# EAGLE design hoektronics-cnc-controller (EAGLE 5.12)

## Sheet 1 of 9
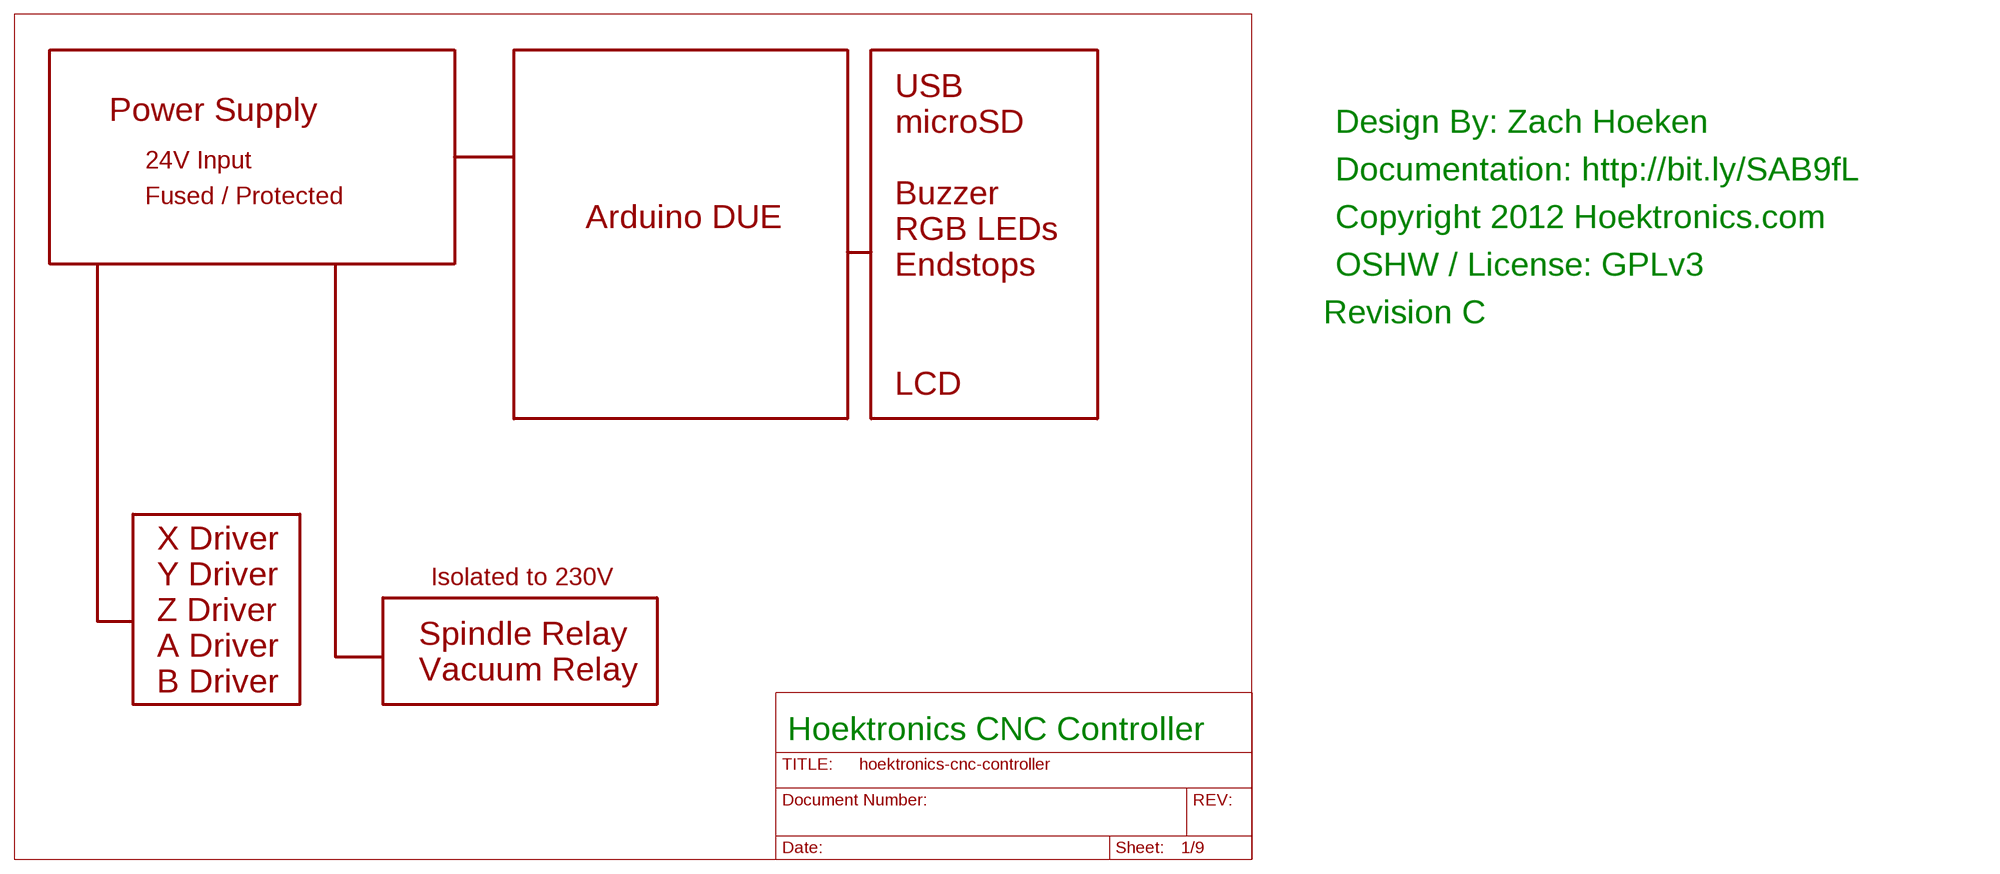
[diagram p0: schematic, sheet 1]

### Notes on the sheet
- USB
- Power Supply
- microSD | Design By: Zach Hoeken
- 24V Input
- Documentation: http://bit.ly/SAB9fL
- Fused / Protected | Buzzer
- Arduino DUE | Copyright 2012 Hoektronics.com
- RGB LEDs
- Endstops | OSHW / License: GPLv3
- Revision C
- LCD
- X Driver
- Y Driver | Isolated to 230V
- Z Driver
- Spindle Relay
- A Driver
- Vacuum Relay
- B Driver
- Hoektronics CNC Controller

## Sheet 2 of 9
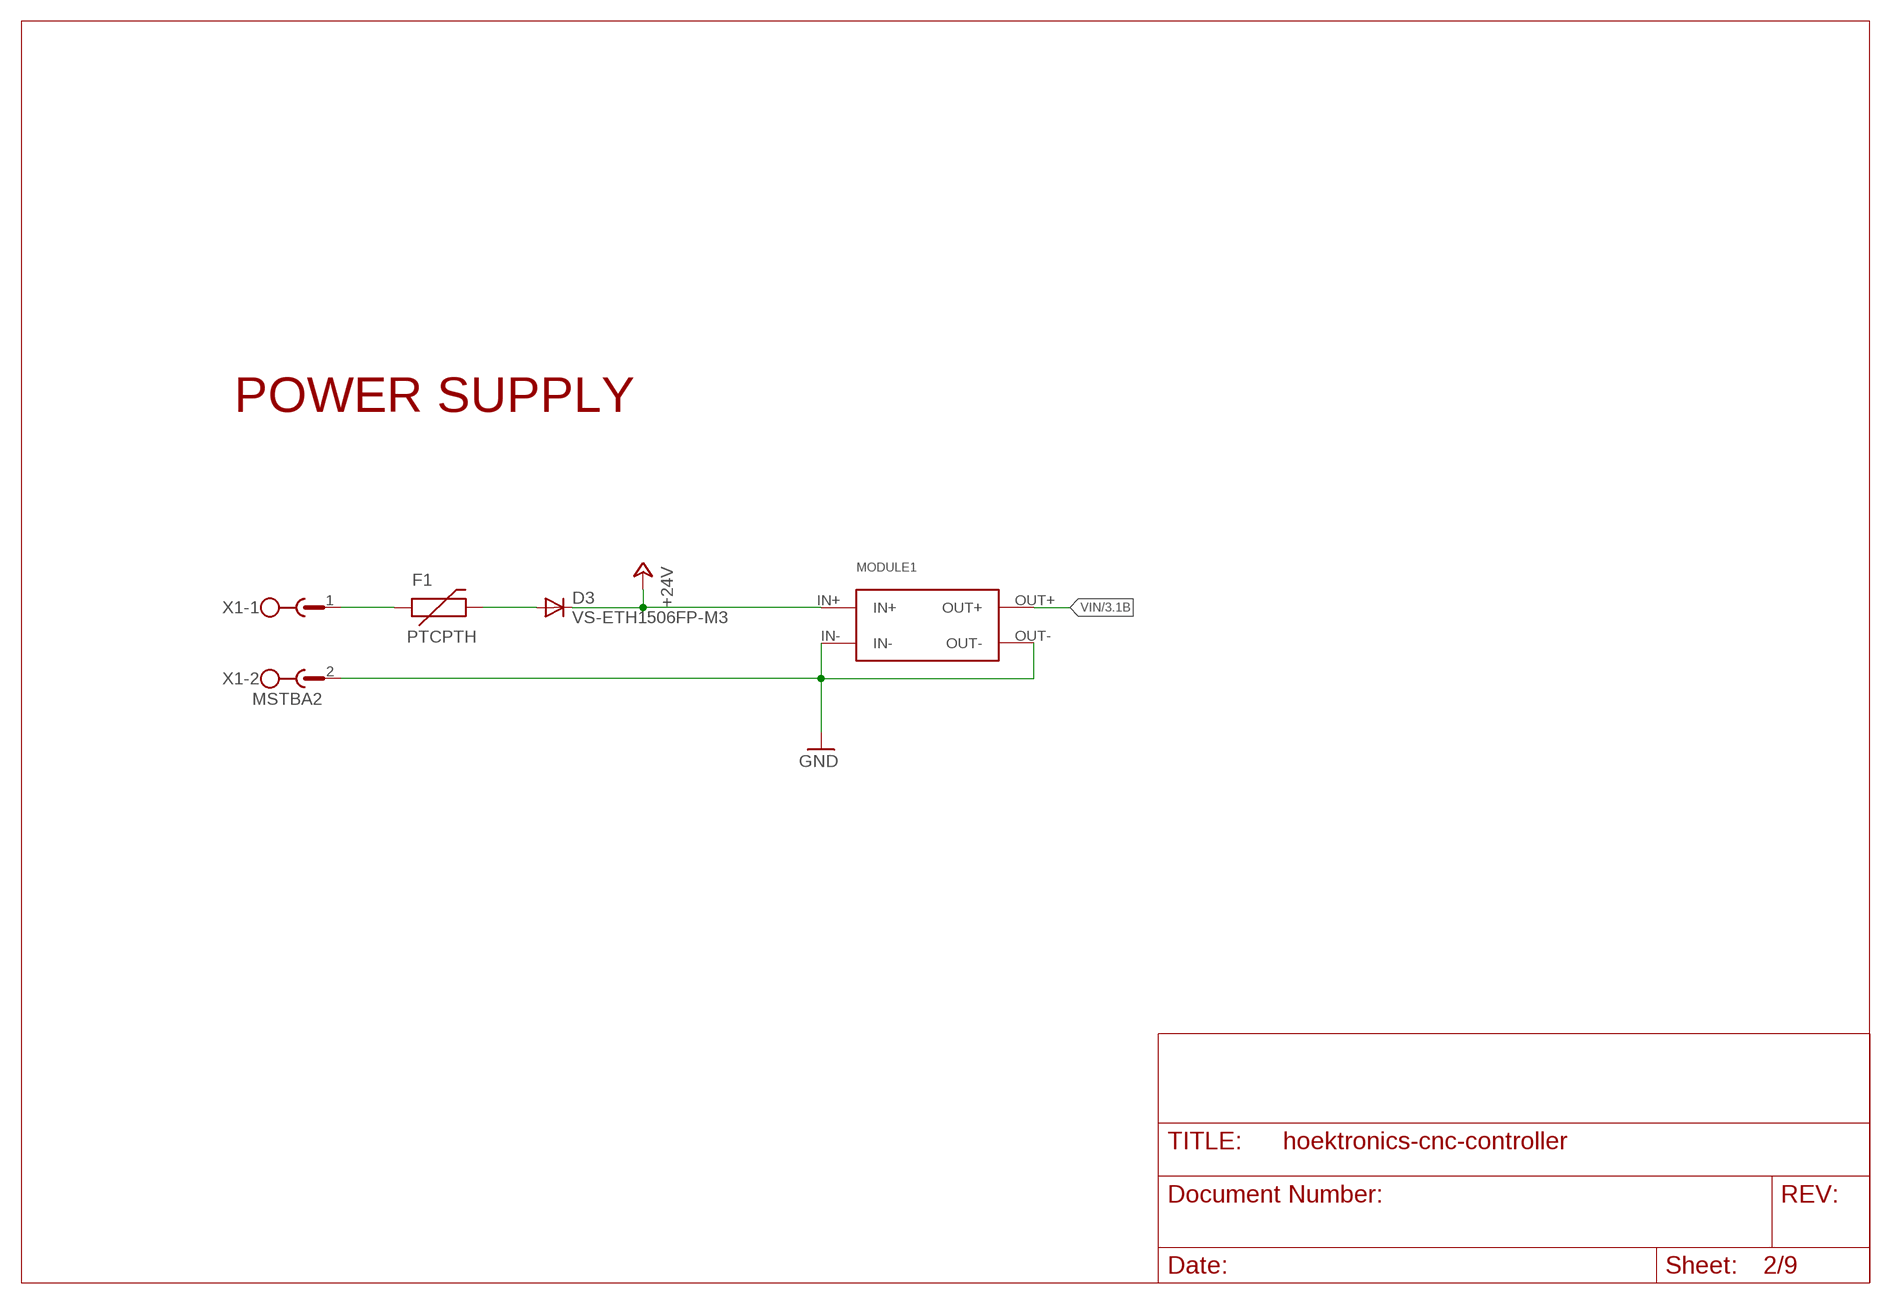
[diagram p1: schematic, sheet 2]

### Parts
D3  VS-ETH1506FP-M3  DIODE-SMC  [SMC]
F1  PTCPTH  [PTC]
MODULE1  DC-DC-CONVERTER  [DC-DC-MODULE]
X1  MSTBA2  [MSTBA2]

### Nets
+24V [power]: D3.C MODULE1.IN+
GND [gnd]: MODULE1.IN- MODULE1.OUT- X1.2 ; also sheet 3,4,5,6,7,8,9
N$28 [power]: D3.A F1.P$2
PRE24 [power]: F1.P$1 X1.1
VIN [power]: MODULE1.OUT+ ; also sheet 3,6

### Notes on the sheet
- POWER SUPPLY

## Sheet 3 of 9
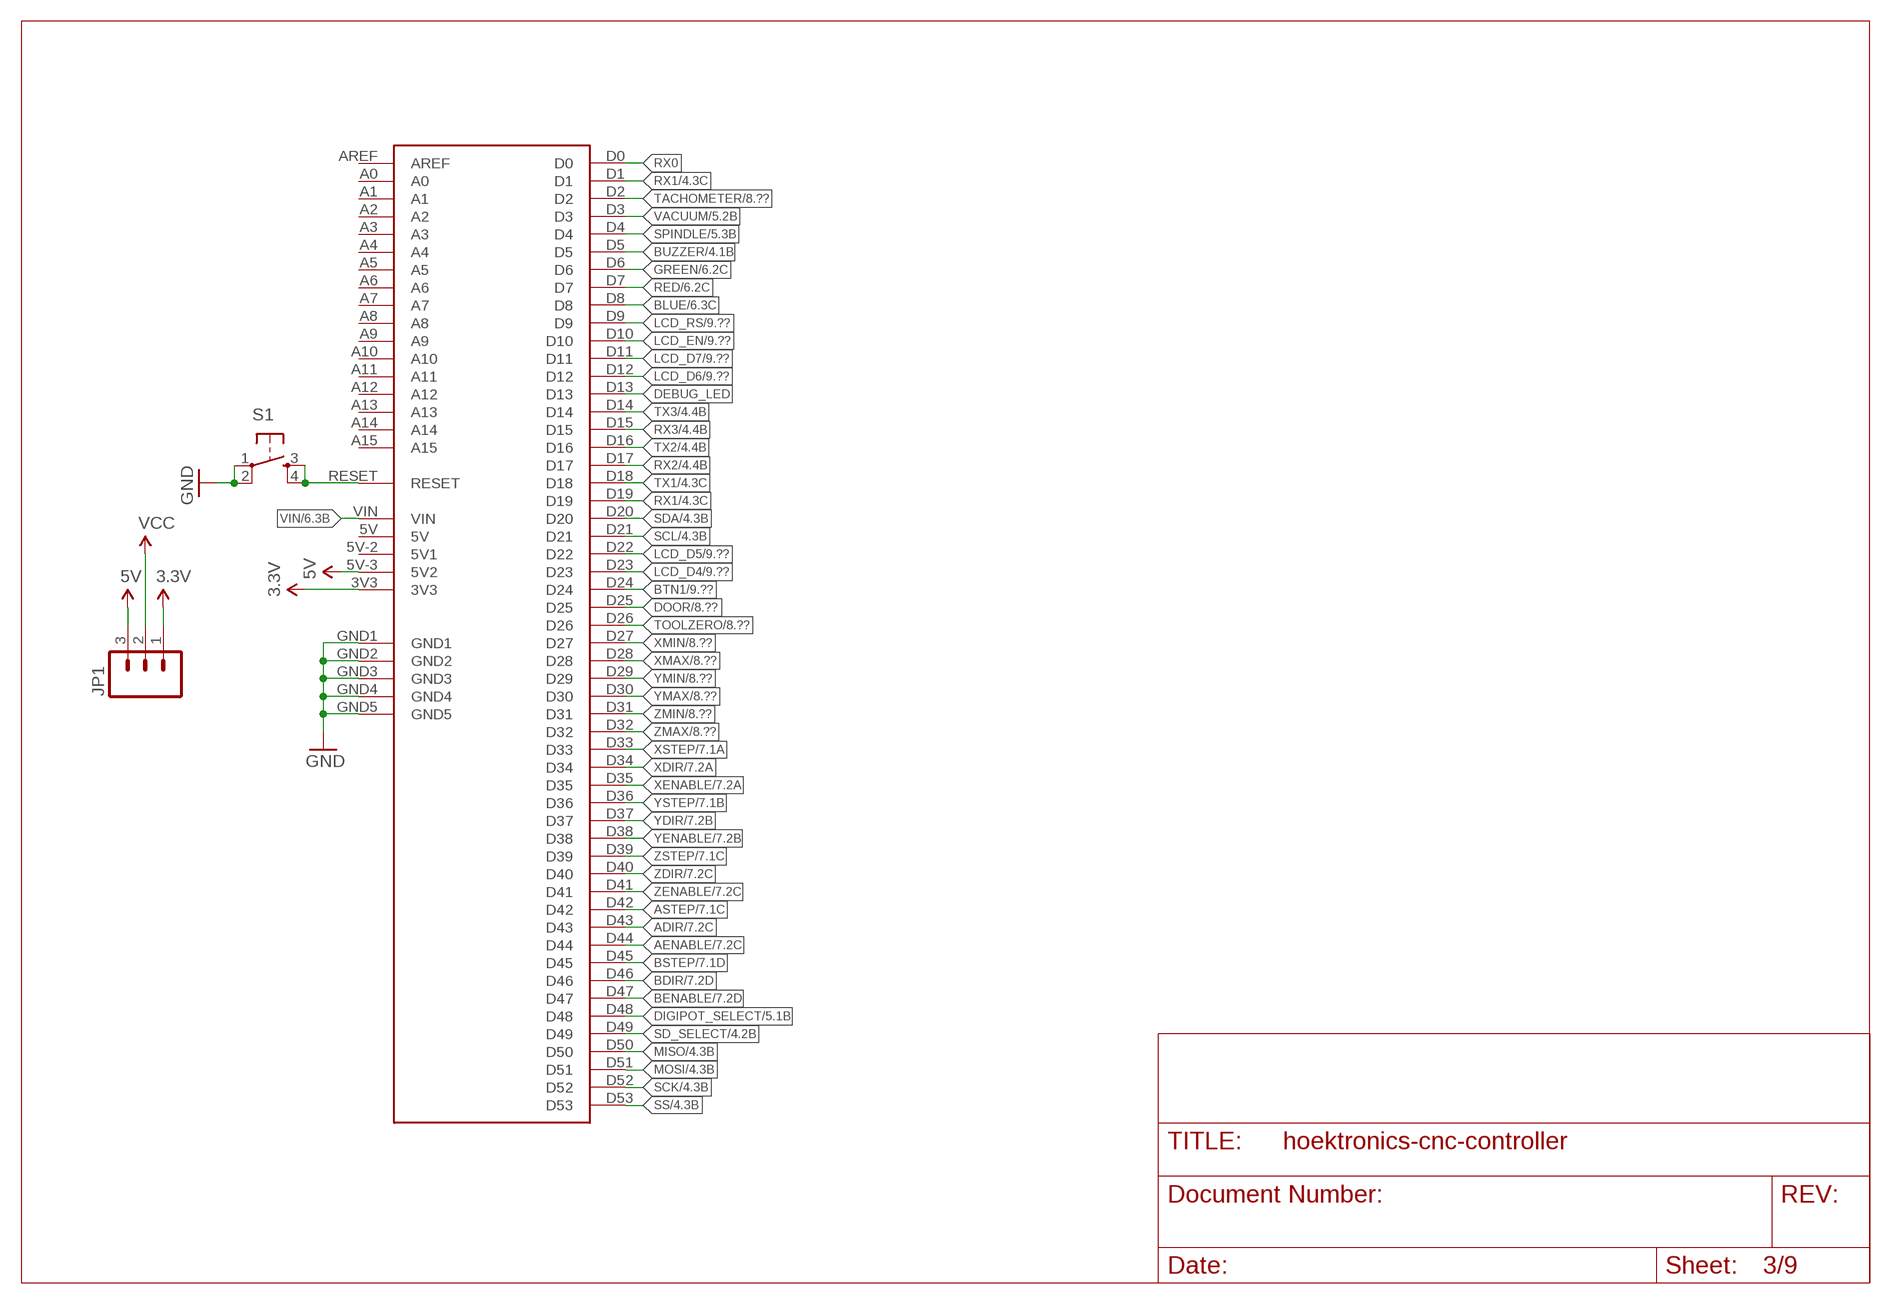
[diagram p2: schematic, sheet 3]

### Parts
JP1  M03PTH  [1X03]
S1  TAC_SWITCHSMD  [TACTILE_SWITCH_SMD]
U$1  ARDUINO-MEGA  [ARDUINO-MEGA]

### Nets
3.3V: JP1.1 U$1.3V3
5V: JP1.3 U$1.5V-3(5V2) ; also sheet 4,5,7
ADIR: U$1.D43 ; also sheet 7
AENABLE: U$1.D44 ; also sheet 7
ASTEP: U$1.D42 ; also sheet 7
BDIR: U$1.D46 ; also sheet 7
BENABLE: U$1.D47 ; also sheet 7
BLUE: U$1.D8 ; also sheet 6
BSTEP: U$1.D45 ; also sheet 7
BTN1: U$1.D24 ; also sheet 9
BUZZER: U$1.D5 ; also sheet 4
DEBUG_LED: U$1.D13
DIGIPOT_SELECT: U$1.D48 ; also sheet 5
DOOR: U$1.D25 ; also sheet 8
GND [gnd]: S1.1 S1.2 U$1.GND1 U$1.GND2 U$1.GND3 U$1.GND4 U$1.GND5 ; also sheet 2,4,5,6,7,8,9
GREEN: U$1.D6 ; also sheet 6
LCD_D4: U$1.D23 ; also sheet 9
LCD_D5: U$1.D22 ; also sheet 9
LCD_D6: U$1.D12 ; also sheet 9
LCD_D7: U$1.D11 ; also sheet 9
LCD_EN: U$1.D10 ; also sheet 9
LCD_RS: U$1.D9 ; also sheet 9
MISO [signals]: U$1.D50 ; also sheet 4
MOSI [signals]: U$1.D51 ; also sheet 4,5
N$26: S1.3 S1.4 U$1.RESET
RED: U$1.D7 ; also sheet 6
RX0: U$1.D0
RX1: U$1.D1 U$1.D19 ; also sheet 4
RX2: U$1.D17 ; also sheet 4
RX3: U$1.D15 ; also sheet 4
SCK [signals]: U$1.D52 ; also sheet 4,5
SCL: U$1.D21 ; also sheet 4
SD_SELECT [signals]: U$1.D49 ; also sheet 4
SDA: U$1.D20 ; also sheet 4
SPINDLE: U$1.D4 ; also sheet 5
SS: U$1.D53 ; also sheet 4
TACHOMETER: U$1.D2 ; also sheet 8
TOOLZERO: U$1.D26 ; also sheet 8
TX1: U$1.D18 ; also sheet 4
TX2: U$1.D16 ; also sheet 4
TX3: U$1.D14 ; also sheet 4
VACUUM: U$1.D3 ; also sheet 5
VCC: JP1.2 ; also sheet 4,5,8,9
VIN [power]: U$1.VIN ; also sheet 2,6
XDIR: U$1.D34 ; also sheet 7
XENABLE: U$1.D35 ; also sheet 7
XMAX: U$1.D28 ; also sheet 8
XMIN: U$1.D27 ; also sheet 8
XSTEP: U$1.D33 ; also sheet 7
YDIR: U$1.D37 ; also sheet 7
YENABLE: U$1.D38 ; also sheet 7
YMAX: U$1.D30 ; also sheet 8
YMIN: U$1.D29 ; also sheet 8
YSTEP: U$1.D36 ; also sheet 7
ZDIR: U$1.D40 ; also sheet 7
ZENABLE: U$1.D41 ; also sheet 7
ZMAX: U$1.D32 ; also sheet 8
ZMIN: U$1.D31 ; also sheet 8
ZSTEP: U$1.D39 ; also sheet 7
Unconnected: U$1.5V U$1.5V-2(5V1) U$1.A0 U$1.A1 U$1.A2 U$1.A3 U$1.A4 U$1.A5 U$1.A6 U$1.A7 U$1.A8 U$1.A9 U$1.A10 U$1.A11 U$1.A12 U$1.A13 U$1.A14 U$1.A15 U$1.AREF

## Sheet 4 of 9
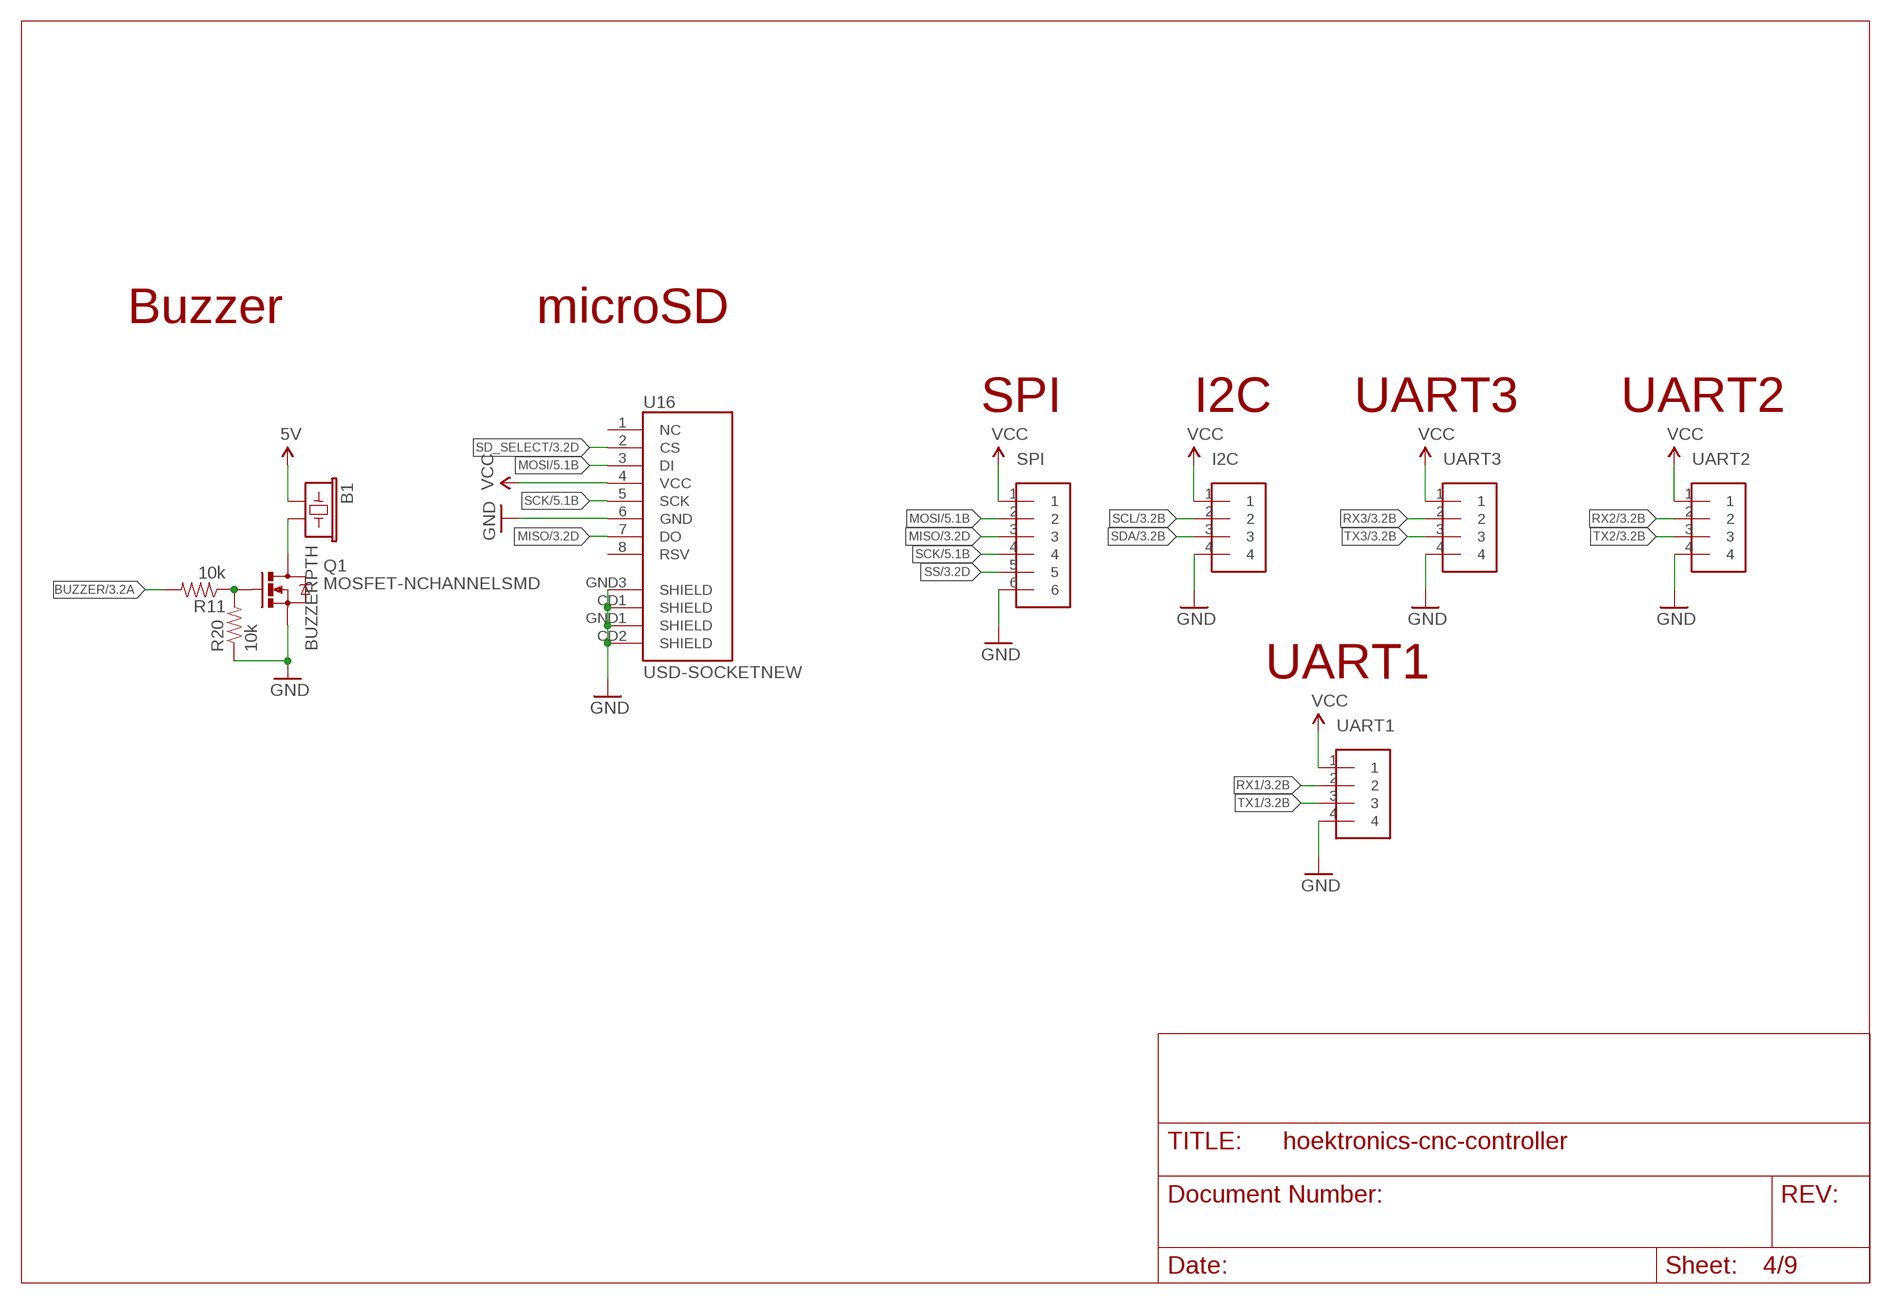
[diagram p3: schematic, sheet 4]

### Parts
B1  BUZZERPTH  [BUZZER-12MM]
I2C  CONN-4  [XH-4]
Q1  MOSFET-NCHANNELSMD  [SOT23-3]
R11  10k  RESISTOR0603  [0603-RC]
R20  10k  RESISTOR0603  [0603-RC]
SPI  CONN-6  [XH-6]
U16  USD-SOCKETNEW  [MICRO-SD-SOCKET-PP]
UART1  CONN-4  [XH-4]
UART2  CONN-4  [XH-4]
UART3  CONN-4  [XH-4]

### Nets
5V: B1.+ ; also sheet 3,5,7
BUZZER: R11.2 ; also sheet 3
GND [gnd]: I2C.4 Q1.2(S) R20.1 SPI.6 U16.6(GND) U16.CD1(SHIELD) U16.CD2(SHIELD) U16.GND1(SHIELD) U16.GND3(SHIELD) UART1.4 UART2.4 UART3.4 ; also sheet 2,3,5,6,7,8,9
MISO [signals]: SPI.3 U16.7(DO) ; also sheet 3
MOSI [signals]: SPI.2 U16.3(DI) ; also sheet 3,5
N$25: Q1.1(G) R11.1 R20.2
N$38 [signals]: B1.- Q1.3(D)
RX1: UART1.2 ; also sheet 3
RX2: UART2.2 ; also sheet 3
RX3: UART3.2 ; also sheet 3
SCK [signals]: SPI.4 U16.5(SCK) ; also sheet 3,5
SCL: I2C.2 ; also sheet 3
SD_SELECT [signals]: U16.2(CS) ; also sheet 3
SDA: I2C.3 ; also sheet 3
SS: SPI.5 ; also sheet 3
TX1: UART1.3 ; also sheet 3
TX2: UART2.3 ; also sheet 3
TX3: UART3.3 ; also sheet 3
VCC: I2C.1 SPI.1 U16.4(VCC) UART1.1 UART2.1 UART3.1 ; also sheet 3,5,8,9
Unconnected: U16.1(NC) U16.8(RSV)

### Notes on the sheet
- Buzzer | microSD
- SPI | I2C | UART3 | UART2
- UART1

## Sheet 5 of 9
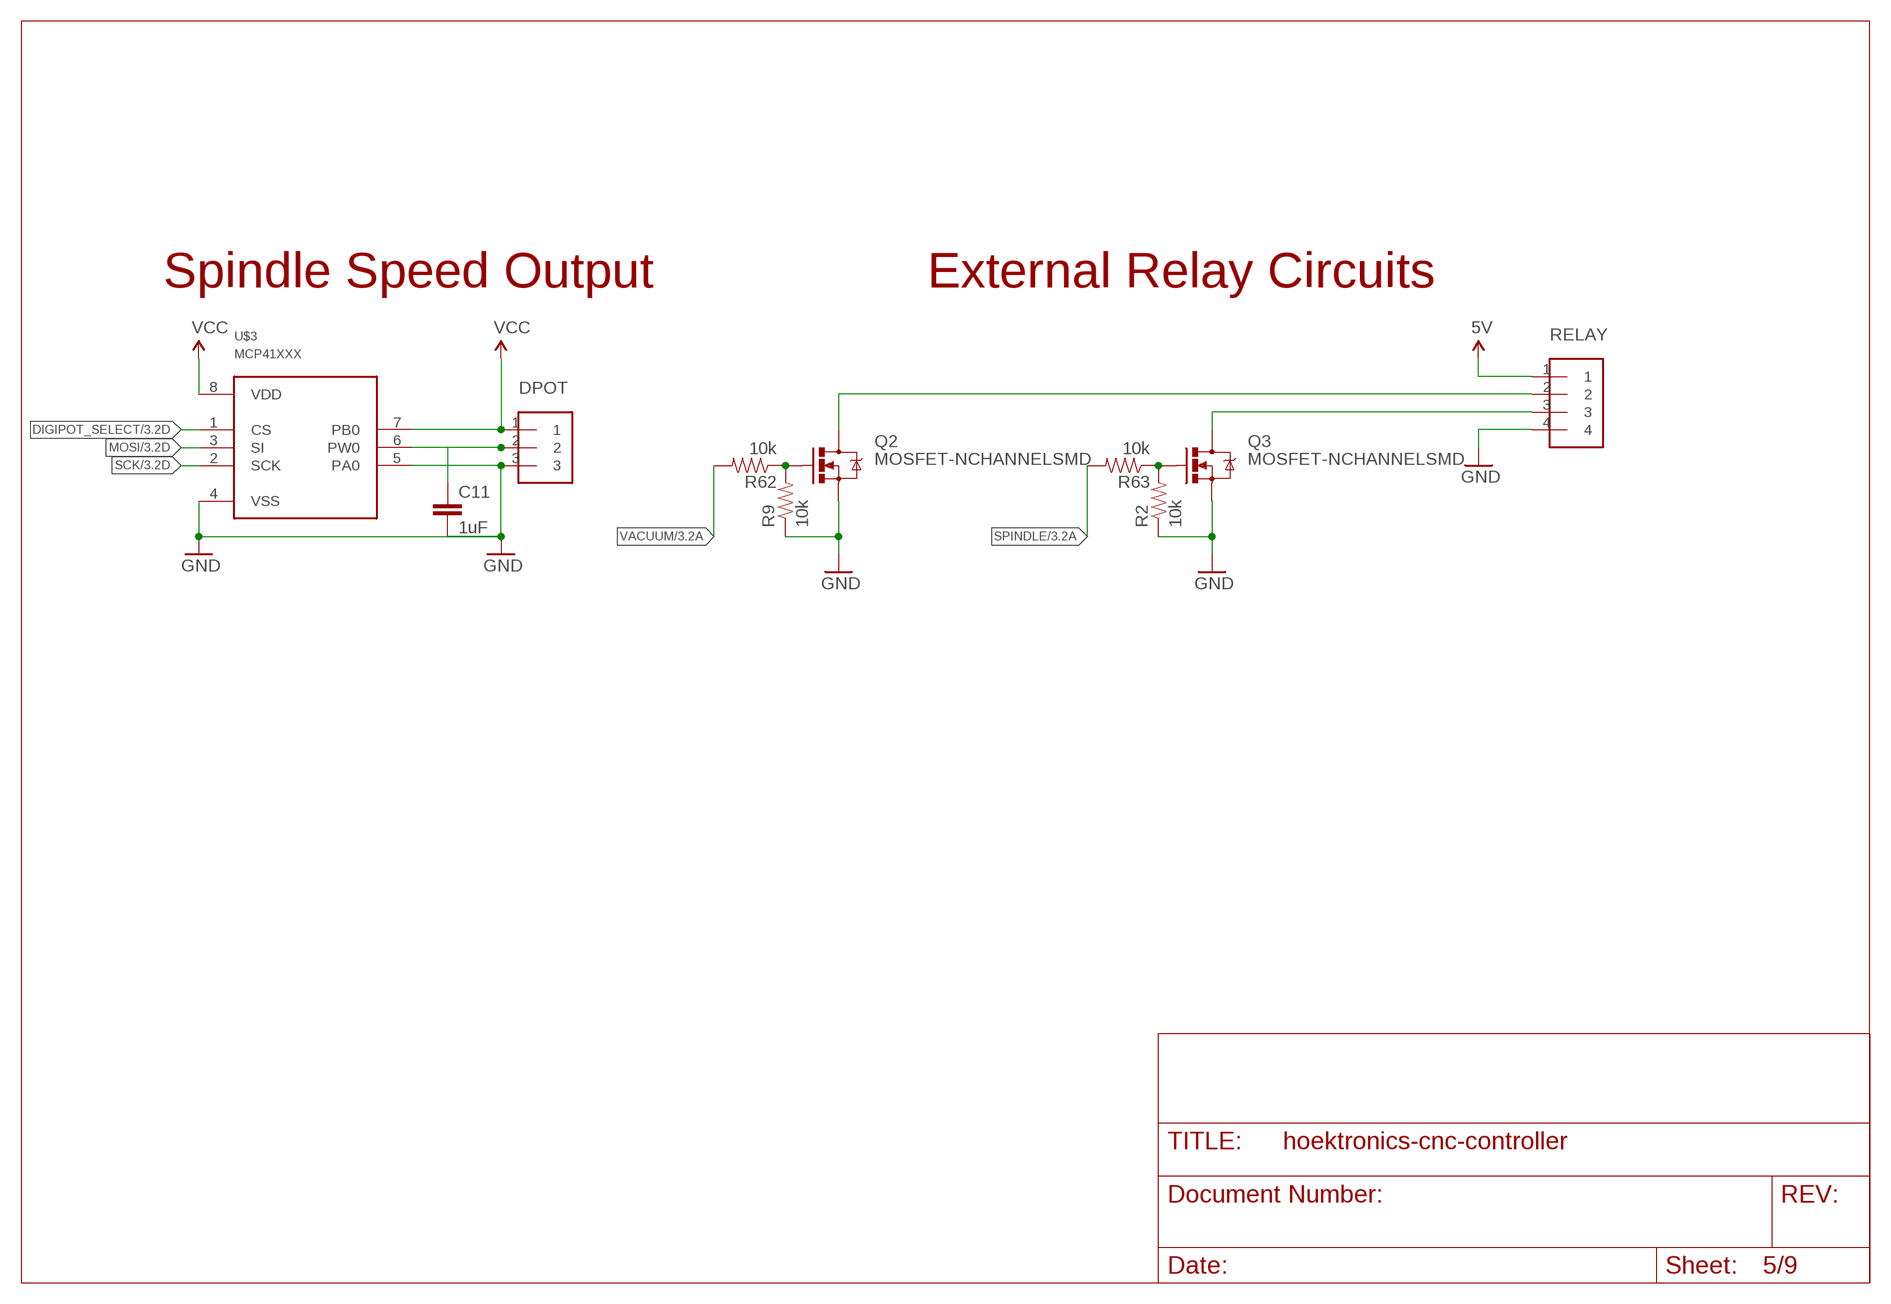
[diagram p4: schematic, sheet 5]

### Parts
C11  1uF  CAPACITOR0603  [0603-RC]
DPOT  CONN-3XH-3  [XH-3]
Q2  MOSFET-NCHANNELSMD  [SOT23-3]
Q3  MOSFET-NCHANNELSMD  [SOT23-3]
R2  10k  RESISTOR0603  [0603-RC]
R9  10k  RESISTOR0603  [0603-RC]
R62  10k  RESISTOR0603  [0603-RC]
R63  10k  RESISTOR0603  [0603-RC]
RELAY  CONN-4  [XH-4]
U$3  MCP41XXX  [SO-08]

### Nets
5V: RELAY.1 ; also sheet 3,4,7
DIGIPOT_SELECT: U$3.1(CS) ; also sheet 3
GND [gnd]: C11.2 DPOT.3 Q2.2(S) Q3.2(S) R2.1 R9.1 RELAY.4 U$3.4(VSS) U$3.5(PA0) ; also sheet 2,3,4,6,7,8,9
MOSI [signals]: U$3.3(SI) ; also sheet 3,4
N$6: C11.1 DPOT.2 U$3.6(PW0)
N$60: Q2.1(G) R9.2 R62.1
N$61: Q3.1(G) R2.2 R63.1
N$62: Q3.3(D) RELAY.3
N$63: Q2.3(D) RELAY.2
SCK [signals]: U$3.2(SCK) ; also sheet 3,4
SPINDLE: R63.2 ; also sheet 3
VACUUM: R62.2 ; also sheet 3
VCC: DPOT.1 U$3.7(PB0) U$3.8(VDD) ; also sheet 3,4,8,9

### Notes on the sheet
- Spindle Speed Output | External Relay Circuits

## Sheet 6 of 9
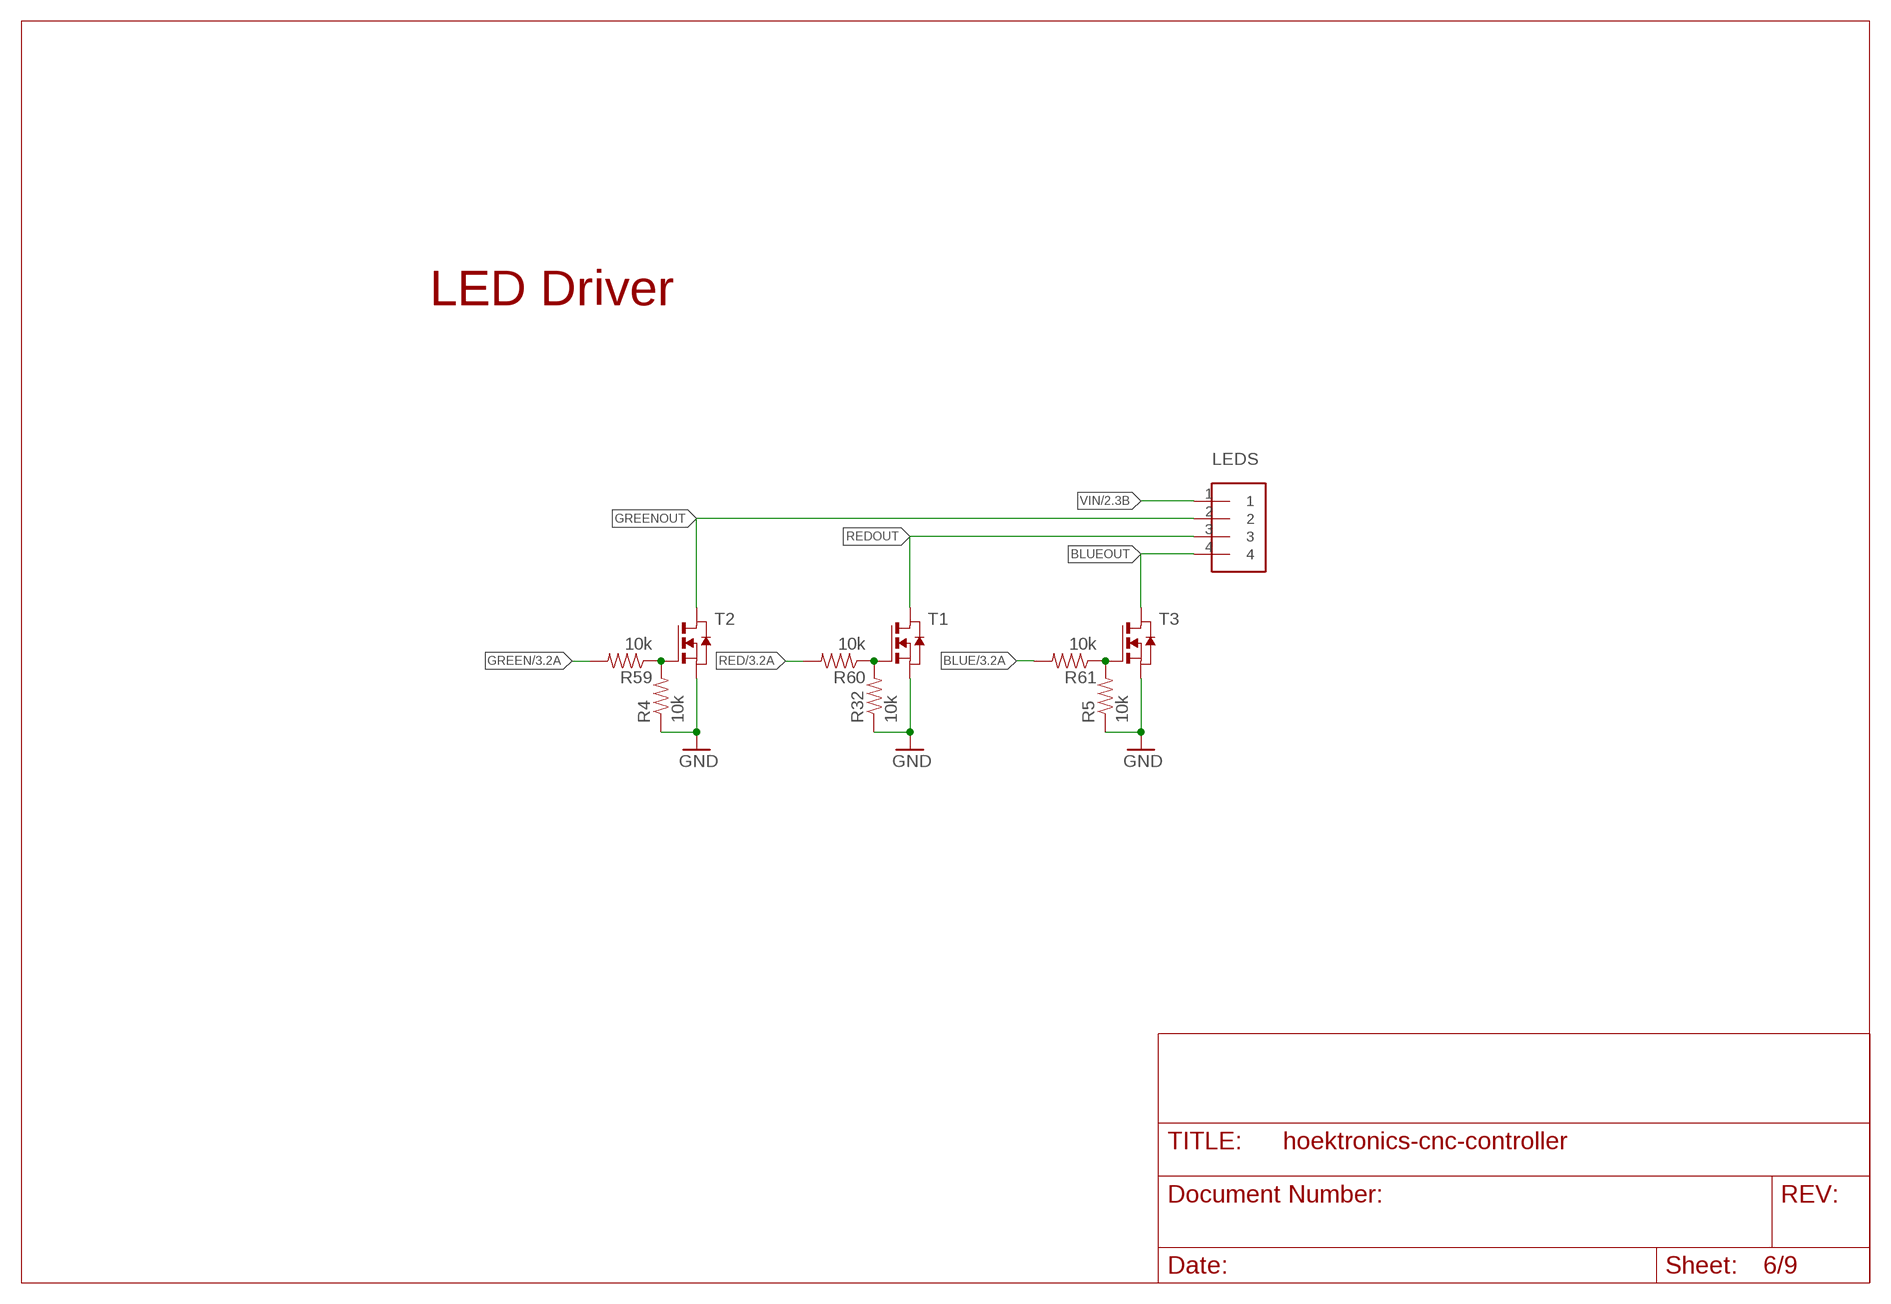
[diagram p5: schematic, sheet 6]

### Parts
LEDS  CONN-4  [XH-4]
R4  10k  RESISTOR0603  [0603-RC]
R5  10k  RESISTOR0603  [0603-RC]
R32  10k  RESISTOR0603  [0603-RC]
R59  10k  RESISTOR0603  [0603-RC]
R60  10k  RESISTOR0603  [0603-RC]
R61  10k  RESISTOR0603  [0603-RC]
T1  NMOSSOT89  [SOT89]
T2  NMOSSOT89  [SOT89]
T3  NMOSSOT89  [SOT89]

### Nets
BLUE: R61.2 ; also sheet 3
BLUEOUT: LEDS.4 T3.2(D)
GND [gnd]: R4.1 R5.1 R32.1 T1.3(S) T2.3(S) T3.3(S) ; also sheet 2,3,4,5,7,8,9
GREEN: R59.2 ; also sheet 3
GREENOUT: LEDS.2 T2.2(D)
N$37: R32.2 R60.1 T1.1(G)
N$43: R4.2 R59.1 T2.1(G)
N$44: R5.2 R61.1 T3.1(G)
RED: R60.2 ; also sheet 3
REDOUT: LEDS.3 T1.2(D)
VIN [power]: LEDS.1 ; also sheet 2,3

### Notes on the sheet
- LED Driver

## Sheet 7 of 9
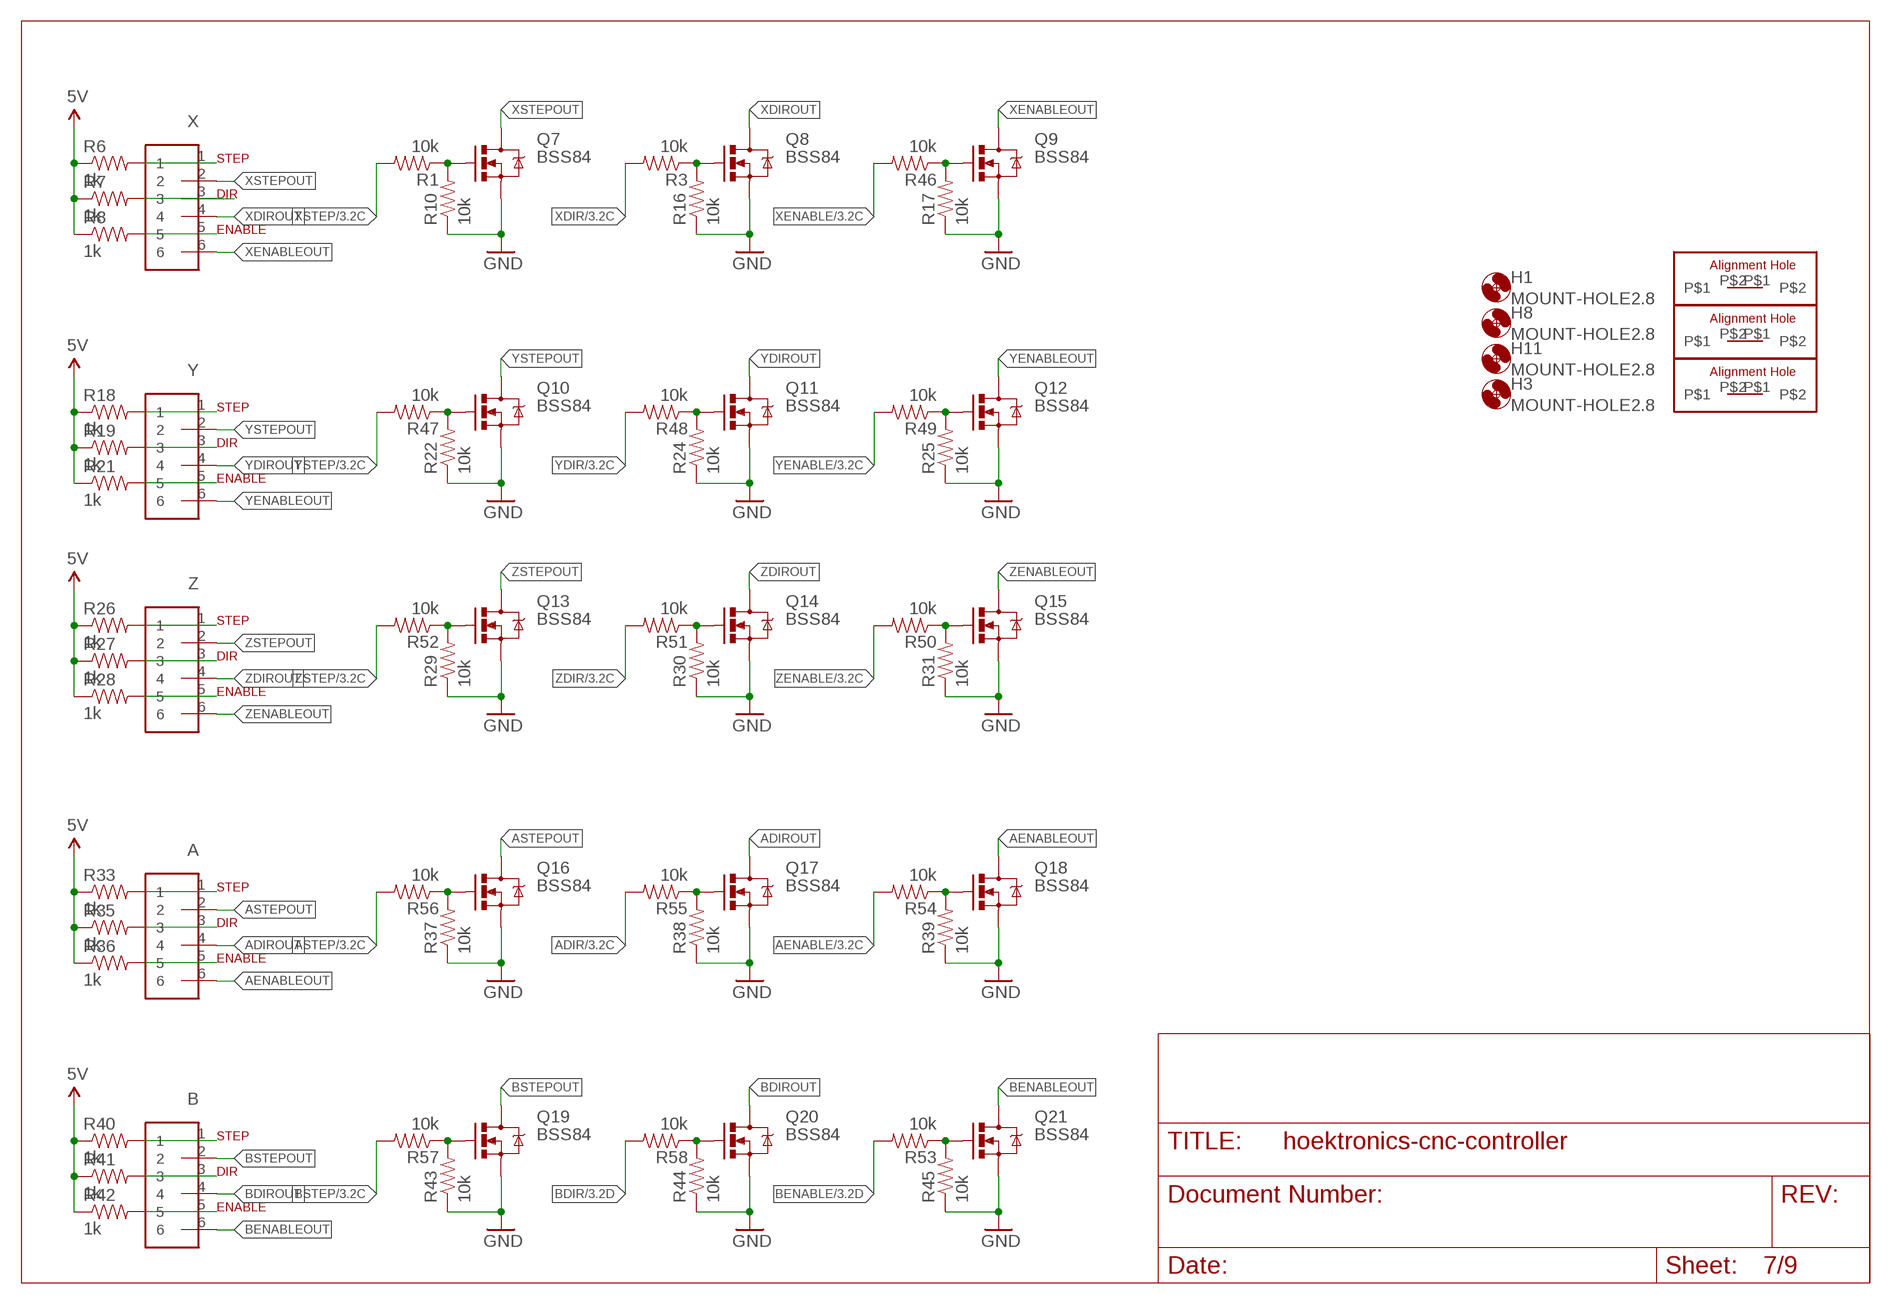
[diagram p6: schematic, sheet 7]

### Parts
A  CONN-6  [XH-6]
B  CONN-6  [XH-6]
H1  MOUNT-HOLE2.8  [2,8]
H3  MOUNT-HOLE2.8  [2,8]
H8  MOUNT-HOLE2.8  [2,8]
H11  MOUNT-HOLE2.8  [2,8]
Q7  BSS84  MOSFET-NCHANNELSMD  [SOT23-3]
Q8  BSS84  MOSFET-NCHANNELSMD  [SOT23-3]
Q9  BSS84  MOSFET-NCHANNELSMD  [SOT23-3]
Q10  BSS84  MOSFET-NCHANNELSMD  [SOT23-3]
Q11  BSS84  MOSFET-NCHANNELSMD  [SOT23-3]
Q12  BSS84  MOSFET-NCHANNELSMD  [SOT23-3]
Q13  BSS84  MOSFET-NCHANNELSMD  [SOT23-3]
Q14  BSS84  MOSFET-NCHANNELSMD  [SOT23-3]
Q15  BSS84  MOSFET-NCHANNELSMD  [SOT23-3]
Q16  BSS84  MOSFET-NCHANNELSMD  [SOT23-3]
Q17  BSS84  MOSFET-NCHANNELSMD  [SOT23-3]
Q18  BSS84  MOSFET-NCHANNELSMD  [SOT23-3]
Q19  BSS84  MOSFET-NCHANNELSMD  [SOT23-3]
Q20  BSS84  MOSFET-NCHANNELSMD  [SOT23-3]
Q21  BSS84  MOSFET-NCHANNELSMD  [SOT23-3]
R1  10k  RESISTOR0603  [0603-RC]
R3  10k  RESISTOR0603  [0603-RC]
R6  1k  RESISTOR0603  [0603-RC]
R7  1k  RESISTOR0603  [0603-RC]
R8  1k  RESISTOR0603  [0603-RC]
R10  10k  RESISTOR0603  [0603-RC]
R16  10k  RESISTOR0603  [0603-RC]
R17  10k  RESISTOR0603  [0603-RC]
R18  1k  RESISTOR0603  [0603-RC]
R19  1k  RESISTOR0603  [0603-RC]
R21  1k  RESISTOR0603  [0603-RC]
R22  10k  RESISTOR0603  [0603-RC]
R24  10k  RESISTOR0603  [0603-RC]
R25  10k  RESISTOR0603  [0603-RC]
R26  1k  RESISTOR0603  [0603-RC]
R27  1k  RESISTOR0603  [0603-RC]
R28  1k  RESISTOR0603  [0603-RC]
R29  10k  RESISTOR0603  [0603-RC]
R30  10k  RESISTOR0603  [0603-RC]
R31  10k  RESISTOR0603  [0603-RC]
R33  1k  RESISTOR0603  [0603-RC]
R35  1k  RESISTOR0603  [0603-RC]
R36  1k  RESISTOR0603  [0603-RC]
R37  10k  RESISTOR0603  [0603-RC]
R38  10k  RESISTOR0603  [0603-RC]
R39  10k  RESISTOR0603  [0603-RC]
R40  1k  RESISTOR0603  [0603-RC]
R41  1k  RESISTOR0603  [0603-RC]
R42  1k  RESISTOR0603  [0603-RC]
R43  10k  RESISTOR0603  [0603-RC]
R44  10k  RESISTOR0603  [0603-RC]
R45  10k  RESISTOR0603  [0603-RC]
R46  10k  RESISTOR0603  [0603-RC]
R47  10k  RESISTOR0603  [0603-RC]
R48  10k  RESISTOR0603  [0603-RC]
R49  10k  RESISTOR0603  [0603-RC]
R50  10k  RESISTOR0603  [0603-RC]
R51  10k  RESISTOR0603  [0603-RC]
R52  10k  RESISTOR0603  [0603-RC]
R53  10k  RESISTOR0603  [0603-RC]
R54  10k  RESISTOR0603  [0603-RC]
R55  10k  RESISTOR0603  [0603-RC]
R56  10k  RESISTOR0603  [0603-RC]
R57  10k  RESISTOR0603  [0603-RC]
R58  10k  RESISTOR0603  [0603-RC]
U$13  ALIGNMENT-HOLE2.5  [ALIGNMENT-HOLE-2.5MM]
U$14  ALIGNMENT-HOLE2.5  [ALIGNMENT-HOLE-2.5MM]
U$15  ALIGNMENT-HOLE2.5  [ALIGNMENT-HOLE-2.5MM]
X  CONN-6  [XH-6]
Y  CONN-6  [XH-6]
Z  CONN-6  [XH-6]

### Nets
5V: R6.1 R7.1 R8.1 R18.1 R19.1 R21.1 R26.1 R27.1 R28.1 R33.1 R35.1 R36.1 R40.1 R41.1 R42.1 ; also sheet 3,4,5
ADIR: R55.2 ; also sheet 3
ADIROUT: A.4 Q17.3(D)
AENABLE: R54.2 ; also sheet 3
AENABLEOUT: A.6 Q18.3(D)
ASTEP: R56.2 ; also sheet 3
ASTEPOUT: A.2 Q16.3(D)
BDIR: R58.2 ; also sheet 3
BDIROUT: B.4 Q20.3(D)
BENABLE: R53.2 ; also sheet 3
BENABLEOUT: B.6 Q21.3(D)
BSTEP: R57.2 ; also sheet 3
BSTEPOUT: B.2 Q19.3(D)
GND [gnd]: Q7.2(S) Q8.2(S) Q9.2(S) Q10.2(S) Q11.2(S) Q12.2(S) Q13.2(S) Q14.2(S) Q15.2(S) Q16.2(S) Q17.2(S) Q18.2(S) Q19.2(S) Q20.2(S) Q21.2(S) R10.1 R16.1 R17.1 R22.1 R24.1 R25.1 R29.1 R30.1 R31.1 R37.1 R38.1 R39.1 R43.1 R44.1 R45.1 ; also sheet 2,3,4,5,6,8,9
N$1: R6.2 X.1
N$2: R7.2 X.3
N$3: R8.2 X.5
N$4: R18.2 Y.1
N$5: Q10.1(G) R22.2 R47.1
N$7: R19.2 Y.3
N$8: R21.2 Y.5
N$9: R26.2 Z.1
N$10: R27.2 Z.3
N$11: R28.2 Z.5
N$12: A.1 R33.2
N$13: A.3 R35.2
N$14: A.5 R36.2
N$15: B.1 R40.2
N$16: B.3 R41.2
N$17: B.5 R42.2
N$18: Q19.1(G) R43.2 R57.1
N$19: Q20.1(G) R44.2 R58.1
N$20: Q21.1(G) R45.2 R53.1
N$21: Q16.1(G) R37.2 R56.1
N$22: Q17.1(G) R38.2 R55.1
N$23: Q18.1(G) R39.2 R54.1
N$24: Q11.1(G) R24.2 R48.1
N$29: Q12.1(G) R25.2 R49.1
N$30: Q15.1(G) R31.2 R50.1
N$31: Q14.1(G) R30.2 R51.1
N$35: Q13.1(G) R29.2 R52.1
XDIR: R3.2 ; also sheet 3
XDIRIN [signals]: Q8.1(G) R3.1 R16.2
XDIROUT: Q8.3(D) X.4
XENABLE: R46.2 ; also sheet 3
XENABLEIN [signals]: Q9.1(G) R17.2 R46.1
XENABLEOUT: Q9.3(D) X.6
XSTEP: R1.2 ; also sheet 3
XSTEPIN [signals]: Q7.1(G) R1.1 R10.2
XSTEPOUT: Q7.3(D) X.2
YDIR: R48.2 ; also sheet 3
YDIROUT: Q11.3(D) Y.4
YENABLE: R49.2 ; also sheet 3
YENABLEOUT: Q12.3(D) Y.6
YSTEP: R47.2 ; also sheet 3
YSTEPOUT: Q10.3(D) Y.2
ZDIR: R51.2 ; also sheet 3
ZDIROUT: Q14.3(D) Z.4
ZENABLE: R50.2 ; also sheet 3
ZENABLEOUT: Q15.3(D) Z.6
ZSTEP: R52.2 ; also sheet 3
ZSTEPOUT: Q13.3(D) Z.2
Unconnected: U$13.P$1 U$13.P$2 U$14.P$1 U$14.P$2 U$15.P$1 U$15.P$2

### Notes on the sheet
- STEP
- DIR
- ENABLE
- STEP
- DIR
- ENABLE
- STEP
- DIR
- ENABLE
- STEP
- DIR
- ENABLE
- STEP
- DIR
- ENABLE

## Sheet 8 of 9
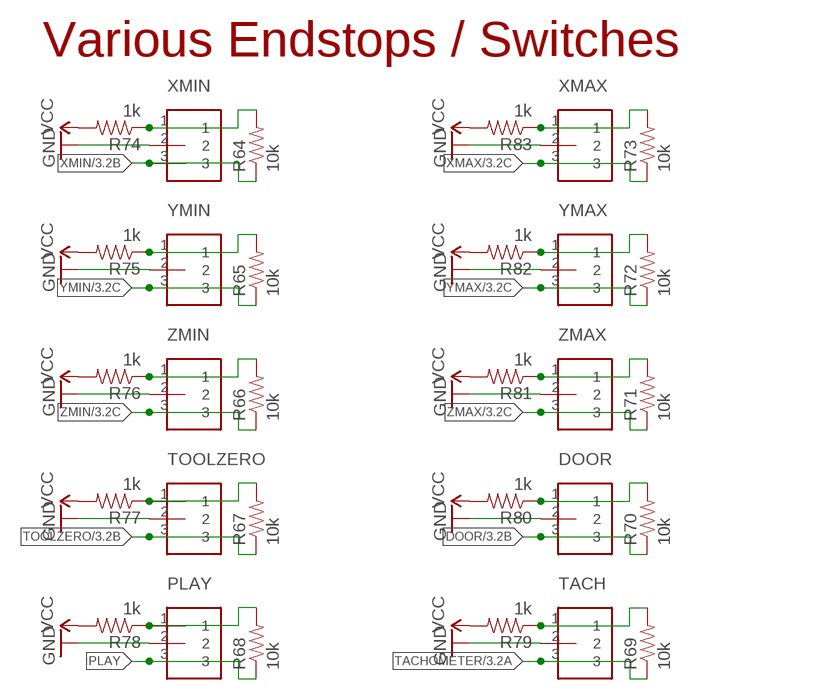
[diagram p7: schematic, sheet 8]

### Parts
DOOR  CONN-3XH-3  [XH-3]
PLAY  CONN-3XH-3  [XH-3]
R64  10k  RESISTOR0603  [0603-RC]
R65  10k  RESISTOR0603  [0603-RC]
R66  10k  RESISTOR0603  [0603-RC]
R67  10k  RESISTOR0603  [0603-RC]
R68  10k  RESISTOR0603  [0603-RC]
R69  10k  RESISTOR0603  [0603-RC]
R70  10k  RESISTOR0603  [0603-RC]
R71  10k  RESISTOR0603  [0603-RC]
R72  10k  RESISTOR0603  [0603-RC]
R73  10k  RESISTOR0603  [0603-RC]
R74  1k  RESISTOR0603  [0603-RC]
R75  1k  RESISTOR0603  [0603-RC]
R76  1k  RESISTOR0603  [0603-RC]
R77  1k  RESISTOR0603  [0603-RC]
R78  1k  RESISTOR0603  [0603-RC]
R79  1k  RESISTOR0603  [0603-RC]
R80  1k  RESISTOR0603  [0603-RC]
R81  1k  RESISTOR0603  [0603-RC]
R82  1k  RESISTOR0603  [0603-RC]
R83  1k  RESISTOR0603  [0603-RC]
TACH  CONN-3XH-3  [XH-3]
TOOLZERO  CONN-3XH-3  [XH-3]
XMAX  CONN-3XH-3  [XH-3]
XMIN  CONN-3XH-3  [XH-3]
YMAX  CONN-3XH-3  [XH-3]
YMIN  CONN-3XH-3  [XH-3]
ZMAX  CONN-3XH-3  [XH-3]
ZMIN  CONN-3XH-3  [XH-3]

### Nets
DOOR: DOOR.3 R70.1 ; also sheet 3
GND [gnd]: DOOR.2 PLAY.2 TACH.2 TOOLZERO.2 XMAX.2 XMIN.2 YMAX.2 YMIN.2 ZMAX.2 ZMIN.2 ; also sheet 2,3,4,5,6,7,9
N$64: R72.2 R82.1 YMAX.1
N$67: R71.2 R81.1 ZMAX.1
N$82: R73.2 R83.1 XMAX.1
N$83: PLAY.1 R68.2 R78.1
N$84: R67.2 R77.1 TOOLZERO.1
N$85: R66.2 R76.1 ZMIN.1
N$86: R65.2 R75.1 YMIN.1
N$87: R64.2 R74.1 XMIN.1
N$88: R69.2 R79.1 TACH.1
N$89: DOOR.1 R70.2 R80.1
PLAY: PLAY.3 R68.1
TACHOMETER: R69.1 TACH.3 ; also sheet 3
TOOLZERO: R67.1 TOOLZERO.3 ; also sheet 3
VCC: R74.2 R75.2 R76.2 R77.2 R78.2 R79.2 R80.2 R81.2 R82.2 R83.2 ; also sheet 3,4,5,9
XMAX: R73.1 XMAX.3 ; also sheet 3
XMIN: R64.1 XMIN.3 ; also sheet 3
YMAX: R72.1 YMAX.3 ; also sheet 3
YMIN: R65.1 YMIN.3 ; also sheet 3
ZMAX: R71.1 ZMAX.3 ; also sheet 3
ZMIN: R66.1 ZMIN.3 ; also sheet 3

### Notes on the sheet
- Various Endstops / Switches

## Sheet 9 of 9
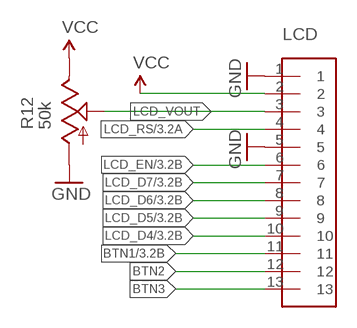
[diagram p8: schematic, sheet 9]

### Parts
LCD  CONN-13  [XH-13]
R12  50k  TRIM_US-CT6  [CT6]

### Nets
BTN1: LCD.11 ; also sheet 3
BTN2: LCD.12
BTN3: LCD.13
GND [gnd]: LCD.1 LCD.5 R12.A ; also sheet 2,3,4,5,6,7,8
LCD_D4: LCD.10 ; also sheet 3
LCD_D5: LCD.9 ; also sheet 3
LCD_D6: LCD.8 ; also sheet 3
LCD_D7: LCD.7 ; also sheet 3
LCD_EN: LCD.6 ; also sheet 3
LCD_RS: LCD.4 ; also sheet 3
LCD_VOUT: LCD.3 R12.S
VCC: LCD.2 R12.E ; also sheet 3,4,5,8

## Library data of the parts
A B SPI X Y Z = Hoektronics:CONN-6
B1 = SparkFun:BUZZER: Buzzer 12mm Spark Fun Electronics SKU : Comp-Buzzer
C11 = Hoektronics:CAPACITOR: Capacitor Standard 0603 ceramic capacitor, and 0.1" leaded capacitor.
D3 = diode:DIODE-: DIODE
DOOR DPOT PLAY TACH TOOLZERO XMAX XMIN YMAX YMIN ZMAX ZMIN = Hoektronics:CONN-3
F1 = SparkFun:PTC: Resettable Fuse PTC Resettable Fuse. Spark Fun Electronics SKU : COM-08357
H1 H3 H8 H11 = holes:MOUNT-HOLE: MOUNTING HOLE with drill center marker
I2C LEDS RELAY UART1-UART3 = Hoektronics:CONN-4
JP1 = SparkFun:M03: Header 3 Standard 3-pin 0.1" header. Use with straight break away headers (SKU : PRT-00116), right angle break away headers (PRT-00553), swiss pins (PRT-00743), machine pins (PRT-00117), and female headers (PRT-00115). Molex polarized connector foot print use with SKU : PRT-08232 with associated crimp pins and housings.
LCD = Hoektronics:CONN-13
MODULE1 = Hoektronics:DC-DC-CONVERTER
Q1-Q3 Q7-Q21 = SparkFun:MOSFET-NCHANNEL
R1-R11 R16-R22 R24-R33 R35-R83 = Hoektronics:RESISTOR: Resistor Basic schematic elements and footprints for 0603, 1206, and PTH 1/10th watt (small) resistors.
R12 = pot:TRIM_US-: POTENTIOMETER
S1 = SparkFun:TAC_SWITCH: Momentary Switch Button commonly used for reset or general input. Spark Fun Electronics SKU : COM-00097
T1-T3 = zetex:NMOSSOT89: MOS FET; OC_FARNELL: unknown; OC_NEWARK: unknown
U16 = SparkFun:USD-SOCKET: microSD Socket Push-push type uSD socket. Schematic element and footprint production proven. Spark Fun Electronics SKU : PRT-00127. tDoc lines correctly indicate media card edge positions when inserting (unlocked, locked, depressed).
U$1 = MakerBot:ARDUINO-MEGA
U$3 = Hoektronics:MCP41XXX
U$13-U$15 = Hoektronics:ALIGNMENT-HOLE
X1 = con-phoenix-508:MSTBA2: PHOENIX; MF: FARNELL; MPN: 1757242; OC_FARNELL: 3705171; OC_NEWARK: 71C4161

## Net classes
0 default: width 0.254 mm, clearance 0.254 mm
1 power: width 1.524 mm, clearance 0.635 mm
2 gnd: width 0.381 mm, clearance 0.254 mm
3 signals: width 0.254 mm, clearance 0.254 mm

## Board
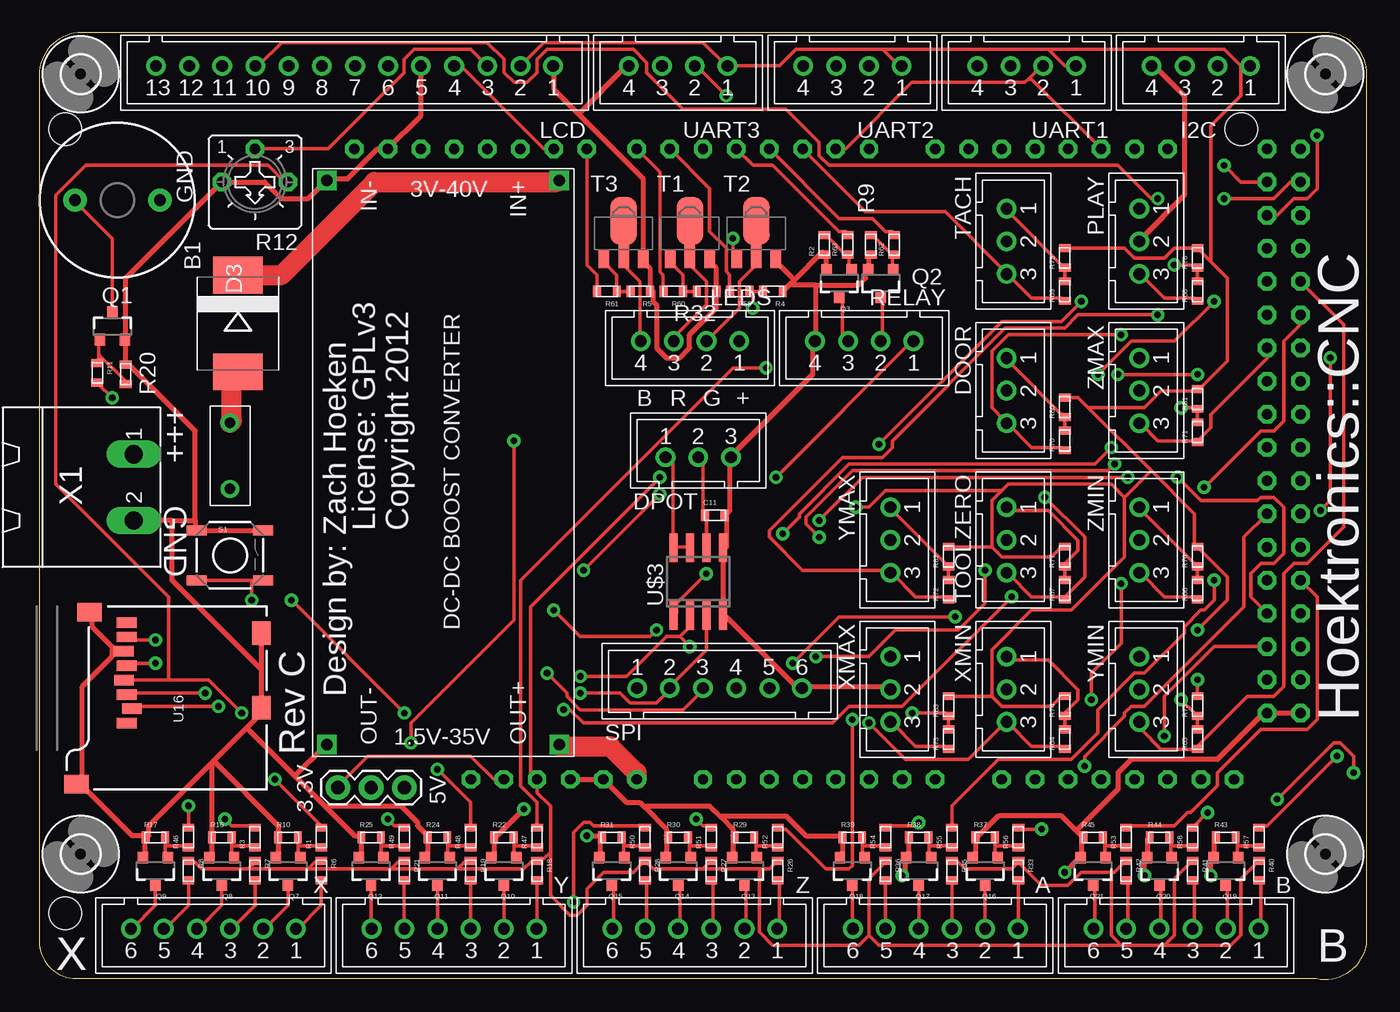
[diagram p9: board, top side]
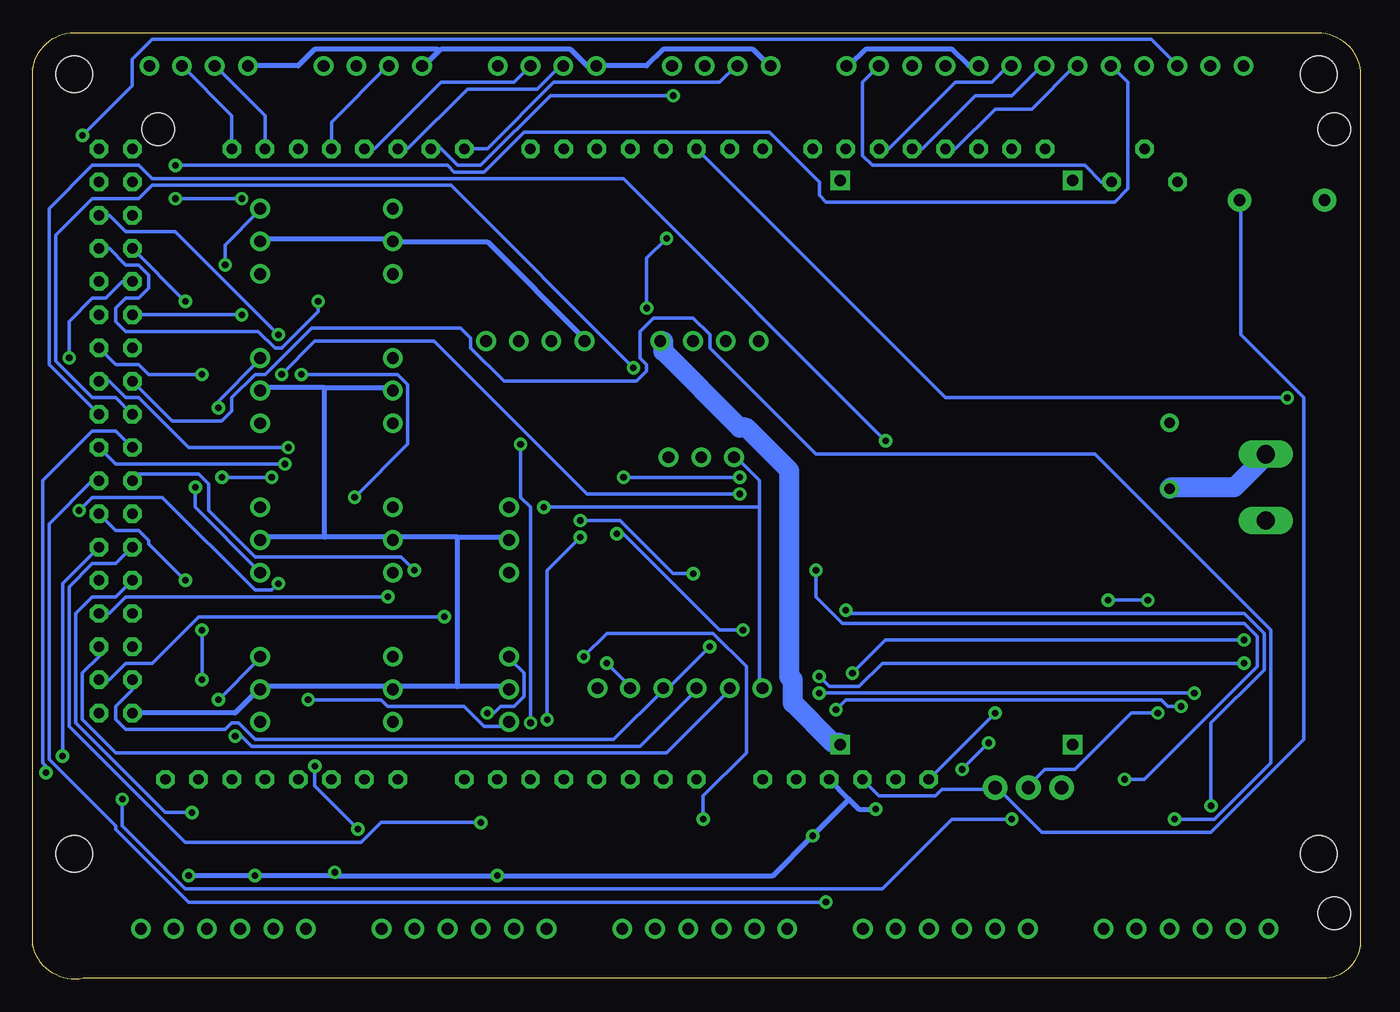
[diagram p10: board, bottom side, seen from below]

Size 101.6 x 72.45 mm. Coordinates in mm from the lower left corner, seen from the top.
Outline: 3.24,72.45 arc90 0,69.21 0,2.9 arc90 2.84,0.06 97.74,0.06 arc90 101.6,2.65 101.6,69.28 arc90 98.42,72.45 3.24,72.45
Copper layers (1*16): Top 0.035mm / dielectric 1.5mm / Bottom 0.035mm
Design rules "hoektronics *": minimum track width 8mil, minimum drill 20mil, track to track 8mil, track to pad 8mil, pad to pad 8mil, via to via 8mil, smd to smd 8mil, copper to edge 15mil, drill to drill 8mil, minimum pad ring 12mil, minimum via ring 10mil, stop-mask expansion 4mil, vias tented up to drill 25mil, thermal gap 10mil

### Footprints (pad centres in the part's own frame; a part is rotated, then mirrored left to right if it is on the bottom)
XH-6 = drill 0.9 round: 1 -6.31,0; 2 -3.81,0; 3 -1.27,0; 4 1.27,0; 5 3.81,0; 6 6.31,0
BUZZER-12MM = drill 0.9 pad 1.778 round: + 3.25,0; - -3.25,0
0603-RC = smd 0.6 x 0.9: 1 -0.75,0; 2 0.75,0
SMC = smd 2.8 x 3.8: A 3.7,0; C -3.7,0
XH-3 = drill 0.9 round: 1 -2.5,0; 2 0,0; 3 2.5,0
PTC = drill 0.8 round: P$1 -2.54,0; P$2 2.54,0
2,8 = hole 2.8: 0,0
XH-4 = drill 0.9 round: 1 -3.77,0; 2 -1.27,0; 3 1.23,0; 4 3.77,0
1X03 = drill 1.016 pad 1.88 round: 1 0,0; 2 2.54,0; 3 5.08,0
XH-13 = drill 0.9 round: 1 -6.31,0; 2 -3.81,0; 3 -1.27,0; 4 1.27,0; 5 3.81,0; 6 6.31,0; 7 8.85,0; 8 11.39,0; 9 13.93,0; 10 16.47,0; 11 19.01,0; 12 21.55,0; 13 24.09,0
DC-DC-MODULE = drill 0.9 square: IN+ -21.59,8.89; IN- -21.59,-8.89; OUT+ 21.59,8.89; OUT- 21.59,-8.89
SOT23-3 = smd 0.8 x 0.9: 1 -0.95,-1; 2 0.95,-1; 3 0,1.1
CT6 = drill 0.813 octagon: A 2.515,0; E -2.515,0; S 0,-2.54
TACTILE_SWITCH_SMD = smd 1.524 x 0.762: 1 -2.54,1.905; 2 2.54,1.905; 3 -2.54,-1.905; 4 2.54,-1.905
SOT89 = smd 0.8 x 1.4: 1 -1.499,-1.981; 3 1.499,-1.981 | smd 0.8 x 1.9: 2 0,-1.727 | smd 2.032 x 3.65: 2@1 0,0.94
MICRO-SD-SOCKET-PP = smd 0.8 x 1.5: 1 -8.94,10.7; 2 -7.84,10.3; 3 -6.74,10.7; 4 -5.64,10.9; 5 -4.54,10.7; 6 -3.44,10.9; 7 -2.34,10.7; 8 -1.24,10.7 | smd 1.8 x 1.4: CD1 -2.05,0.4; CD2 -7.75,0.4 | smd 1.4 x 1.9: GND1 -13.6,14.55; GND3 -0.45,13.55
ARDUINO-MEGA = drill 0.8 octagon: 3V3 35.56,2.54; 5V 93.98,50.8; 5V-2 96.52,50.8; 5V-3 38.1,2.54; A0 50.8,2.54; A1 53.34,2.54; A2 55.88,2.54; A3 58.42,2.54; A4 60.96,2.54; A5 63.5,2.54; A6 66.04,2.54; A7 68.58,2.54; A8 73.66,2.54; A9 76.2,2.54; A10 78.74,2.54; A11 81.28,2.54; A12 83.82,2.54; A13 86.36,2.54; A14 88.9,2.54; A15 91.44,2.54; AREF 24.13,50.8; D0 63.5,50.8; D1 60.96,50.8; D2 58.42,50.8; D3 55.88,50.8; D4 53.34,50.8; D5 50.8,50.8; D6 48.26,50.8; D7 45.72,50.8; D8 41.91,50.8; D9 39.37,50.8; D10 36.83,50.8; D11 34.29,50.8; D12 31.75,50.8; D13 29.21,50.8; D14 68.58,50.8; D15 71.12,50.8; D16 73.66,50.8; D17 76.2,50.8; D18 78.74,50.8; D19 81.28,50.8; D20 83.82,50.8; D21 86.36,50.8; D22 93.98,48.26; D23 96.52,48.26; D24 93.98,45.72; D25 96.52,45.72; D26 93.98,43.18; D27 96.52,43.18; D28 93.98,40.64; D29 96.52,40.64; D30 93.98,38.1; D31 96.52,38.1; D32 93.98,35.56; D33 96.52,35.56; D34 93.98,33.02; D35 96.52,33.02; D36 93.98,30.48; D37 96.52,30.48; D38 93.98,27.94; D39 96.52,27.94; D40 93.98,25.4; D41 96.52,25.4; D42 93.98,22.86; D43 96.52,22.86; D44 93.98,20.32; D45 96.52,20.32; D46 93.98,17.78; D47 96.52,17.78; D48 93.98,15.24; D49 96.52,15.24; D50 93.98,12.7; D51 96.52,12.7; D52 93.98,10.16; D53 96.52,10.16; GND1 26.67,50.8; GND2 93.98,7.62; GND3 96.52,7.62; GND4 40.64,2.54; GND5 43.18,2.54; RESET 33.02,2.54; VIN 45.72,2.54
SO-08 = smd 0.6 x 2.2: 1 -1.905,-2.6; 2 -0.635,-2.6; 3 0.635,-2.6; 4 1.905,-2.6; 5 1.905,2.6; 6 0.635,2.6; 7 -0.635,2.6; 8 -1.905,2.6
ALIGNMENT-HOLE-2.5MM = smd 2.5 x 2.5: P$1 0,0 | smd 2.5 x 2.5 bottom: P$2 0,0 | hole 2.5: 0,0
MSTBA2 = drill 1.397 long: 1 -2.54,5.08; 2 2.54,5.08

### Placement (x,y rotation side)
A  68.58,3.87 180 top
B  87,3.87 180 top
B1  5.99,59.64 0 top
C11  51.7,35.51 0 top
D3  15.21,50.2 270 top
DOOR  74.04,45.05 270 top
DPOT  50.44,39.96 0 top
F1  14.61,40.07 90 top
H1  98.42,9.59 0 top
H3  3.17,69.28 0 top
H8  3.17,9.59 180 top
H11  98.42,69.28 0 top
I2C  88.9,69.91 180 top
JP1  22.86,14.67 0 top
LCD  33.02,69.91 180 top
LEDS  49.8,48.85 180 top
MODULE1  30.91,39.55 270 top
PLAY  84.2,56.48 270 top
Q1  5.61,49.96 0 top
Q2  64.41,53.29 180 top
Q3  61.23,53.29 180 top
Q7  19.05,8.32 180 top
Q8  13.97,8.32 180 top
Q9  8.89,8.32 180 top
Q10  35.56,8.32 180 top
Q11  30.48,8.32 180 top
Q12  25.4,8.32 180 top
Q13  53.98,8.32 180 top
Q14  48.9,8.32 180 top
Q15  43.81,8.32 180 top
Q16  72.39,8.32 180 top
Q17  67.31,8.32 180 top
Q18  62.23,8.32 180 top
Q19  90.81,8.32 180 top
Q20  85.72,8.32 180 top
Q21  80.64,8.32 180 top
R1  21.59,10.86 90 top
R2  60.09,56.21 90 top
R3  16.51,10.86 90 top
R4  56.15,52.66 180 top
R5  45.99,52.66 180 top
R6  21.59,8.32 270 top
R7  16.51,8.32 270 top
R8  11.43,8.32 270 top
R9  63.64,56.21 90 top
R10  19.05,10.86 0 top
R11  4.45,46.42 270 top
R12  16.51,61.02 180 top
R16  13.97,10.86 0 top
R17  8.89,10.86 0 top
R18  38.1,8.32 270 top
R19  33.02,8.32 270 top
R20  6.62,46.31 270 top
R21  27.94,8.32 270 top
R22  35.56,10.86 0 top
R24  30.48,10.86 0 top
R25  25.4,10.86 0 top
R26  56.52,8.32 270 top
R27  51.44,8.32 270 top
R28  46.35,8.32 270 top
R29  53.98,10.86 0 top
R30  48.9,10.86 0 top
R31  43.81,10.86 0 top
R32  51.07,52.66 180 top
R33  74.93,8.32 270 top
R35  69.85,8.32 270 top
R36  64.77,8.32 270 top
R37  72.39,10.86 0 top
R38  67.31,10.86 0 top
R39  62.23,10.86 0 top
R40  93.34,8.32 270 top
R41  88.27,8.32 270 top
R42  83.19,8.32 270 top
R43  90.81,10.86 0 top
R44  85.72,10.86 0 top
R45  80.64,10.86 0 top
R46  11.43,10.86 90 top
R47  38.1,10.86 90 top
R48  33.02,10.86 90 top
R49  27.94,10.86 90 top
R50  46.35,10.86 90 top
R51  51.44,10.86 90 top
R52  56.52,10.86 90 top
R53  83.19,10.86 90 top
R54  64.77,10.86 90 top
R55  69.85,10.86 90 top
R56  74.93,10.86 90 top
R57  93.34,10.86 90 top
R58  88.27,10.86 90 top
R59  53.61,52.66 180 top
R60  48.53,52.66 180 top
R61  43.45,52.66 180 top
R62  65.42,56.21 90 top
R63  61.87,56.21 90 top
R64  78.48,18.38 90 top
R65  88.64,18.38 90 top
R66  88.64,29.81 90 top
R67  78.48,29.81 90 top
R68  88.64,52.67 90 top
R69  78.48,52.67 90 top
R70  78.48,41.24 90 top
R71  88.64,41.88 90 top
R72  69.59,29.81 90 top
R73  69.59,18.38 90 top
R74  78.48,20.92 90 top
R75  88.64,20.92 90 top
R76  88.64,32.35 90 top
R77  78.48,32.35 90 top
R78  88.64,55.21 90 top
R79  78.48,55.21 90 top
R80  78.48,43.78 90 top
R81  88.64,44.42 90 top
R82  69.59,32.35 90 top
R83  69.59,20.92 90 top
RELAY  63.13,48.85 180 top
S1  14.61,32.45 0 top
SPI  52.07,22.29 0 top
T1  49.8,57.1 0 top
T2  54.88,57.1 0 top
T3  44.72,57.1 0 top
TACH  74.04,56.48 270 top
TOOLZERO  74.04,33.62 270 top
U16  17.4,28.54 90 top
U$1  0,12.76 0 top
U$3  50.44,30.43 0 top
U$13  2,5.06 0 top
U$14  2,65.06 0 top
U$15  92,65.06 0 top
UART1  75.56,69.91 180 top
UART2  62.23,69.91 180 top
UART3  48.9,69.91 180 top
X  13.34,3.87 180 top
X1  2.15,37.65 270 top
XMAX  65.15,22.19 270 top
XMIN  74.04,22.19 270 top
Y  31.75,3.87 180 top
YMAX  65.15,33.62 270 top
YMIN  84.2,22.19 270 top
Z  50.16,3.87 180 top
ZMAX  84.2,45.05 270 top
ZMIN  84.2,33.62 270 top

### Tracks (layer width: path | path; a pad name or v marks a point on that pad's centre or on a via)
3.3V
  Top 0.254: U$1.3V3 34.8,15.3 33.02,17.08 25.15,17.08 22.86,14.79 JP1.1
5V  (via drill 0.51)
  Top 0.254: 50.8,8.44 46.99,8.44 46.48,8.95 R28.1 46.23,8.95 45.47,8.19 43.18,8.19 41.91,6.92 41.91,5.65 41.15,4.89 40.64,4.89 39.12,6.41 39.12,9.71 | 50.8,8.44 51.31,8.95 R27.1 | 50.8,8.44 55.12,8.44 | 55.12,8.44 55.88,8.44 56.39,8.95 R26.1 | 63.5,3.36 63.5,7.68 64.77,8.95 R36.1 | 63.5,3.36 62.74,2.6 56.13,2.6 55.12,3.62 55.12,8.44 | 74.93,8.95 74.42,8.44 70.87,8.44 70.36,8.95 69.85,8.95 R35.1 | 82.04,8.19 79.76,8.19 78.74,7.17 76.71,7.17 74.93,8.95 | 82.04,8.19 82.3,8.19 83.06,8.95 R42.1 | 74.93,8.95 R33.1 | 86.11,2.6 86.87,3.36 86.87,7.68 88.14,8.95 R41.1 | 82.8,2.6 86.11,2.6 | 82.8,2.6 82.04,3.36 82.04,8.19 | 86.11,2.6 91.19,2.6 91.95,3.36 91.95,7.68 93.22,8.95 R40.1 | 63.5,3.36 64.26,2.6 82.8,2.6 | 16,8.44 12.45,8.44 11.94,8.95 11.43,8.95 R8.1 | 16,8.44 16.51,8.95 R7.1 | 20.57,8.44 21.08,8.95 21.59,8.95 R6.1 | 16,8.44 20.57,8.44 | 26.92,8.44 27.43,8.95 27.94,8.95 R21.1 | 20.57,8.44 26.92,8.44 | 32,8.44 32.51,8.95 33.02,8.95 R19.1 | 26.92,8.44 32,8.44 | 32,8.44 37.08,8.44 37.59,8.95 38.1,8.95 R18.1 38.1,9.21 38.61,9.21 39.12,9.71 | 39.12,9.71 39.12,13.27 38.1,14.29 U$1.5V-3 37.59,15.81 37.59,28.51 v47.5,38.42 | v56.39,38.42 66.8,48.83 RELAY.1
  Bottom 0.254: B1.+ 9.14,59.5 9.14,49.34 4.32,44.51 4.32,18.35 11.43,11.24 24.38,11.24 27.94,14.79 JP1.3 27.94,14.54 32,14.54 32.51,14.03 36.83,14.03 U$1.5V-3 | v47.5,38.42 v56.39,38.42
+24V
  Top 1.524: MODULE1.IN+ 39.62,61.02 25.65,61.02 18.54,53.91 15.24,53.91 D3.C
ADIR  (via drill 0.51)
  Top 0.254: v89.92,30.54 89.92,29.02 89.15,28.26 88.9,28.26 87.63,26.99 87.63,26.48 84.58,23.43 83.82,23.43 81.03,20.64 81.03,18.86 78.99,16.83 73.41,16.83 69.85,13.27 R55.2
  Bottom 0.254: v89.92,30.54 92.71,33.34 92.71,33.59 93.47,34.35 95.25,34.35 U$1.D43
ADIROUT
  Top 0.254: A.4 Q17.3
AENABLE  (via drill 0.51)
  Top 0.254: v67.31,12 67.06,11.75 64.77,11.75 R54.2
  Bottom 0.254: v67.31,12 74.93,12 76.45,10.48 89.92,10.48 98.81,19.37 98.81,30.03 97.03,31.81 95.25,31.81 U$1.D44
AENABLEOUT
  Top 0.254: Q18.3 62.23,3.87 A.6
ASTEP  (via drill 0.51)
  Top 0.254: v76.71,11.49 74.93,11.49 R56.2 | v80.01,16.32 80.01,17.08 83.06,20.13 83.06,20.38 83.57,20.89 84.58,20.89 92.2,28.51 92.2,33.84 U$1.D42
  Bottom 0.254: v76.71,11.49 80.01,14.79 v80.01,16.32
ASTEPOUT
  Top 0.254: A.2 Q16.3
BDIR  (via drill 0.51)
  Top 0.254: v89.41,12.76 88.39,11.75 R58.2
  Bottom 0.254: v89.41,12.76 91.44,12.76 98.3,19.62 98.3,28 97.03,29.27 95.25,29.27 U$1.D46
BDIROUT
  Top 0.254: Q20.3 85.85,7.17 85.85,3.87 B.4
BENABLE
  Top 0.254: U$1.D47 97.79,29.27 97.79,19.87 97.03,19.11 93.47,19.11 90.17,15.81 90.17,14.79 88.14,12.76 87.88,12.76 86.87,11.75 83.31,11.75 R53.2
BENABLEOUT
  Top 0.254: Q21.3 80.77,7.17 80.77,3.87 B.6
BLUE
  Top 0.254: U$1.D8 41.91,54.67 42.67,53.91 42.67,52.89 R61.2
BLUEOUT
  Top 0.254: T3.2 44.96,55.18 44.96,54.42 45.97,53.4 45.97,49.08 LEDS.4
BSTEP  (via drill 0.51)
  Top 0.254: v99.31,17.08 93.98,11.75 93.47,11.75 R57.2
  Bottom 0.254: v99.31,17.08 99.31,30.29 U$1.D45
BSTEPOUT
  Top 0.254: Q19.3 90.93,7.17 90.93,3.87 B.2
BTN1  (via drill 0.51)
  Top 0.254: U$1.D24 94.74,58.48 96.01,59.75 97.03,59.75 97.79,60.51 v97.79,64.58
  Bottom 0.254: v97.79,64.58 93.98,68.39 93.98,70.42 92.46,71.94 16,71.94 13.97,69.91 LCD.11
BUZZER  (via drill 0.51)
  Top 0.254: v5.59,44.51 4.57,45.53 R11.2
  Bottom 0.254: v5.59,44.51 31.75,44.51 U$1.D5
DIGIPOT_SELECT  (via drill 0.51)
  Top 0.254: v51.05,31.05 48.77,28.76 48.77,28 U$3.1 | v59.69,35.11 62.99,38.42 v83.31,38.42 | v87.12,38.42 88.9,36.64 93.22,36.64 93.47,36.89 94.49,36.89 95.25,36.13 95.25,32.57 94.49,31.81 93.47,31.81 92.71,31.05 92.71,29.27 U$1.D48
  Bottom 0.254: v51.05,31.05 52.58,31.05 56.64,35.11 v59.69,35.11 | v83.31,38.42 v87.12,38.42
DOOR  (via drill 0.51)
  Top 0.254: R70.1 78.23,40.7 75.95,40.7 74.17,42.48 DOOR.3 73.91,42.73 72.9,43.75 72.9,48.07 74.17,49.34 v82.8,49.34
  Bottom 0.254: U$1.D25 95.76,58.48 94.49,57.21 90.68,57.21 v82.8,49.34
GND  (via drill 0.51)
  Top 0.381: R9.1 63.5,55.43 63.5,54.42 Q2.2 63.25,54.16 63.25,53.66 62.74,53.15 59.44,53.15 | 57.78,53.53 59.94,55.69 R2.1 60.2,55.43 60.2,54.42 Q3.2 | 57.53,53.27 57.78,53.53 | 57.53,53.27 57.15,52.89 R4.1 | 59.44,53.15 57.66,53.15 57.53,53.27 | T2.3 56.39,54.93 57.78,53.53 | 59.44,53.15 59.44,49.08 RELAY.4 59.18,48.83 59.18,46.29 53.09,40.19 DPOT.3 52.83,39.94 52.83,35.88 52.58,35.62 C11.2 52.58,35.37 52.58,33.08 U$3.5 52.32,32.83 52.32,28 U$3.4 52.58,27.75 58.17,22.16 SPI.6 58.42,22.41 65.02,22.41 XMAX.2 | Q18.2 61.47,9.46 61.47,10.73 R39.1 61.47,10.98 58.67,10.98 57.15,12.51 52.32,12.51 52.2,12.38 | Q13.2 53.09,9.46 53.09,10.73 R29.1 53.09,10.98 53.09,11.49 52.2,12.38 | Q14.2 48.01,9.46 48.01,10.73 R30.1 48.01,10.98 48.01,11.49 46.35,13.14 | 46.35,13.14 45.97,13.52 44.96,13.52 U$1.GND5 U$1.GND4 | 52.2,12.38 51.31,13.27 46.48,13.27 46.35,13.14 | Q16.2 71.63,9.46 71.63,10.73 R37.1 71.88,10.98 73.41,12.51 78.23,12.51 79.38,11.36 | 79.38,11.36 79.76,10.98 R45.1 79.76,10.73 79.76,9.46 Q21.2 79.5,9.21 v78.49,8.19 | R43.1 89.92,10.73 89.92,9.46 Q19.2 89.66,9.21 v89.66,7.94 | R44.1 84.84,10.73 84.84,9.46 Q20.2 84.58,9.21 v84.58,7.94 | R38.1 66.55,10.73 66.55,9.46 Q17.2 66.29,9.21 66.29,8.19 v66.04,7.94 | Q15.2 42.93,9.46 42.93,10.73 R31.1 42.93,10.98 v41.91,10.98 | Q10.2 34.8,9.46 34.8,10.73 R22.1 35.05,10.98 v37.08,13.02 | U$1.GND3 U$1.GND2 93.73,20.38 90.17,16.83 83.57,16.83 82.55,15.81 82.55,14.54 79.38,11.36 | S1.2 S1.1 11.94,34.35 11.94,35.11 | 11.94,35.11 11.94,41.97 6.86,47.05 R20.1 6.6,47.31 6.6,48.83 Q1.2 6.6,49.08 6.6,53.66 13.97,61.02 R12.A 17.27,61.02 18.54,59.75 20.57,59.75 21.84,61.02 MODULE1.IN- 22.1,61.28 23.62,61.28 25.91,63.56 U$1.GND1 29.21,66.1 LCD.5
  Top 0.381: 10.16,35.11 11.94,35.11 | 10.16,35.11 7.37,35.11 X1.2 | 5.71,25.33 4.06,26.99 4.06,28 U16.GND3 | 5.71,25.33 5.84,25.21 6.35,25.21 U16.6 | Q9.2 8.13,9.46 8.13,10.73 R17.1 | R17.1 8.13,10.98 7.11,10.98 3.05,15.05 U16.GND1 3.3,15.05 3.3,22.41 5.59,24.7 5.59,25.21 5.71,25.33 | Q11.2 29.72,9.46 29.72,10.73 R24.1 29.72,10.98 28.96,11.75 28.96,12 27.69,13.27 22.1,13.27 21.97,13.14 | Q12.2 24.64,9.46 24.64,10.73 R25.1 24.64,10.98 24.13,10.98 21.97,13.14 | Q7.2 18.29,9.46 18.29,10.73 R10.1 18.29,10.98 18.29,11.75 13.34,16.7 | Q8.2 13.21,9.46 13.21,10.73 R16.1 13.21,10.98 13.21,16.57 | 15.88,19.24 16.76,20.13 16.76,20.64 U16.CD2 17.02,20.89 17.02,23.68 | 13.34,16.7 15.88,19.24 | 13.21,16.57 13.34,16.7 | 19.56,15.56 21.97,13.14 | 15.88,19.24 19.56,15.56 | 17.02,23.68 17.02,26.48 U16.CD1 | 19.56,15.56 21.84,17.84 MODULE1.OUT- | 13.21,16.57 8.38,11.75 8.38,10.98 R17.1 | 10.16,35.11 10.16,30.54 17.02,23.68 | T1.3 51.31,54.93 51.82,54.42 51.82,52.89 R32.1 51.82,52.64 51.82,51.37 49.78,49.34 49.78,48.32 49.02,47.56 48.01,47.56 47.24,48.32 47.24,51.62 46.99,51.88 46.99,52.64 R5.1 46.74,52.89 46.74,54.42 46.23,54.93 T3.3 46.23,55.18 46.23,61.28 41.27,66.23 | 41.27,66.23 39.37,68.13 39.37,69.91 LCD.1 | UART3.4 44.96,69.91 41.27,66.23 | PLAY.2 84.33,56.7 87.63,60.01 87.63,67.63 85.34,69.91 I2C.4
  Bottom 0.381: PLAY.2 84.07,56.7 74.17,56.7 TACH.2 73.91,56.45 66.8,56.45 59.44,49.08 RELAY.4 | v37.08,13.02 38.35,13.02 39.12,13.78 | 39.12,13.78 U$1.GND4 | 39.12,13.78 v41.91,10.98 44.96,7.94 v66.04,7.94 78.49,7.94 | 78.49,7.94 v84.58,7.94 v89.66,7.94 | v78.49,8.19 78.49,7.94 | 79.25,45.27 84.07,45.27 ZMAX.2 | 79.25,45.27 74.17,45.27 DOOR.2 | 69.09,33.84 73.91,33.84 TOOLZERO.2 74.17,33.84 79.25,33.84 | 69.09,33.84 65.28,33.84 YMAX.2 | 79.25,33.84 84.07,33.84 ZMIN.2 | 79.25,33.84 79.25,45.27 | 69.09,22.41 65.28,22.41 XMAX.2 | 69.09,22.41 73.91,22.41 XMIN.2 74.17,22.41 84.07,22.41 YMIN.2 84.33,22.16 86.11,20.38 U$1.GND2 | 69.09,22.41 69.09,33.84 | 70.48,71.05 71.63,69.91 UART1.4 | 70.48,71.05 70.36,71.18 60.45,71.18 59.18,69.91 UART2.4 54.61,69.91 53.34,71.18 46.48,71.18 45.21,69.91 UART3.4 | I2C.4 81.28,69.91 80.01,71.18 70.61,71.18 70.48,71.05 | LCD.5 29.97,69.91 31.24,71.18 37.85,71.18 39.12,69.91 LCD.1
GREEN
  Top 0.254: U$1.D6 51.31,60.51 51.31,57.21 52.58,55.94 52.58,54.16 52.83,53.91 52.83,52.89 R59.2
GREENOUT
  Top 0.254: T2.2 54.86,55.18 54.86,54.67 53.59,53.4 53.59,51.37 51.31,49.08 LEDS.2
LCD_D4  (via drill 0.51)
  Top 0.254: U$1.D23 95.76,61.02 94.49,59.75 v90.68,59.75 | v85.6,59.75 85.09,59.75 82.55,62.29 60.45,62.29 59.69,63.05 59.69,64.07 57.15,66.61 49.28,66.61 46.48,69.4 46.48,70.17 45.47,71.18 38.86,71.18 38.1,70.42 38.1,69.4 37.34,68.64 36.32,68.64 35.56,69.4 35.56,70.42 34.29,71.69 18.54,71.69 16.76,69.91 LCD.10
  Bottom 0.254: v85.6,59.75 v90.68,59.75
LCD_D5  (via drill 0.51)
  Top 0.254: U$1.D22 91.95,61.02 v90.68,62.29
  Bottom 0.254: v90.68,62.29 69.85,62.29 69.34,61.78 67.06,61.78 64.01,64.83 45.21,64.83 41.4,61.02 41.4,60.01 40.89,59.5 18.8,59.5 17.78,60.51 17.78,68.64 19.05,69.91 LCD.9
LCD_D6
  Bottom 0.254: U$1.D12 30.99,63.56 27.94,66.61 25.15,66.61 21.84,69.91 LCD.8
LCD_D7
  Bottom 0.254: U$1.D11 33.53,63.56 29.46,67.63 26.67,67.63 24.38,69.91 LCD.7
LCD_EN
  Bottom 0.254: U$1.D10 36.07,63.56 30.99,68.64 28.19,68.64 26.92,69.91 LCD.6
LCD_RS
  Top 0.254: U$1.D9 38.61,63.56 32.26,69.91 LCD.4
LCD_VOUT
  Top 0.254: R12.S 22.1,63.56 27.94,69.4 27.94,70.42 28.7,71.18 33.02,71.18 LCD.3
MISO  (via drill 0.51)
  Top 0.254: v8.89,25.97 6.86,25.97 U16.7 | v38.86,23.43 40.39,21.91 40.39,21.65 41.4,20.64 49.28,20.64 50.8,22.16 SPI.3 | U$1.D50 89.92,25.46 86.11,21.65 v86.11,18.6
  Bottom 0.254: v8.89,25.97 36.32,25.97 v38.86,23.43 | v86.11,18.6 85.6,18.6 84.84,17.84 55.12,17.84 50.8,22.16 SPI.3
MOSI  (via drill 0.51)
  Top 0.254: v12.7,21.91 6.86,21.91 U16.3 | v41.4,21.91 44.45,21.91 45.21,21.14 47.24,21.14 48.26,22.16 SPI.2 48.26,22.41 51.05,25.21 51.05,27.75 U$3.3
  Bottom 0.254: v12.7,21.91 v41.4,21.91 | U$1.D51 96.52,24.7 97.79,23.43 97.79,19.87 95.25,17.33 53.09,17.33 48.26,22.16 SPI.2
N$1
  Top 0.254: R6.2 21.59,5.65 19.81,3.87 X.1
N$2
  Top 0.254: R7.2 16.51,5.65 14.73,3.87 X.3
N$3
  Top 0.254: R8.2 11.43,5.65 9.65,3.87 X.5
N$4
  Top 0.254: R18.2 38.1,3.87 Y.1
N$5
  Top 0.254: 36.32,10.22 36.32,10.73 R22.2 | 36.32,10.22 36.32,9.46 Q10.1 | 36.32,10.22 38.1,10.22 R47.1
N$6
  Top 0.254: U$3.6 51.05,33.08 51.05,35.37 C11.1 50.8,35.62 50.8,39.69 50.55,39.94 DPOT.2
N$7
  Top 0.254: Y.3 R19.2
N$8
  Top 0.254: Y.5 R21.2
N$9
  Top 0.254: R26.2 56.64,7.43 56.64,3.87 Z.1
N$10
  Top 0.254: R27.2 51.56,7.43 51.56,3.87 Z.3
N$11
  Top 0.254: R28.2 46.48,7.43 46.48,3.87 Z.5
N$12
  Top 0.254: R33.2 74.93,3.87 A.1
N$13
  Top 0.254: A.3 R35.2
N$14
  Top 0.254: A.5 R36.2
N$15
  Top 0.254: R40.2 93.47,7.43 93.47,3.87 B.1
N$16
  Top 0.254: R41.2 88.39,7.43 88.39,3.87 B.3
N$17
  Top 0.254: R42.2 83.31,7.43 83.31,3.87 B.5
N$18
  Top 0.254: 91.69,10.22 91.69,10.73 R43.2 | 91.69,10.22 91.69,9.46 Q19.1 | 91.69,10.22 93.22,10.22 R57.1
N$19
  Top 0.254: 86.61,10.22 86.61,10.73 R44.2 | 86.61,10.22 86.61,9.46 Q20.1 | 86.61,10.22 88.14,10.22 R58.1
N$20
  Top 0.254: 81.53,10.22 81.53,10.73 R45.2 | 81.53,10.22 81.53,9.46 Q21.1 | 81.53,10.22 83.06,10.22 R53.1
N$21
  Top 0.254: 73.15,10.22 73.15,10.73 R37.2 | 73.15,10.22 73.15,9.46 Q16.1 | 73.15,10.22 74.93,10.22 R56.1
N$22
  Top 0.254: 68.07,10.22 68.07,10.73 R38.2 | 68.07,10.22 68.07,9.46 Q17.1 | 68.07,10.22 69.85,10.22 R55.1
N$23
  Top 0.254: 62.99,10.22 62.99,10.73 R39.2 | 62.99,10.22 62.99,9.46 Q18.1 | 62.99,10.22 64.77,10.22 R54.1
N$24
  Top 0.254: 31.24,10.22 31.24,10.73 R24.2 | 31.24,10.22 31.24,9.46 Q11.1 | 31.24,10.22 33.02,10.22 R48.1
N$25
  Top 0.254: 4.57,47.81 4.57,48.83 Q1.1 | 4.57,47.81 4.57,47.31 R11.1 | 4.57,47.81 6.6,45.78 R20.2
N$26  (via drill 0.51)
  Top 0.254: S1.3 16.26,30.54 | 16.26,30.54 S1.4 | v19.3,29.02 v27.94,20.38 | 16.26,30.54 v16.26,29.02
  Bottom 0.254: v27.94,20.38 U$1.RESET | v16.26,29.02 v19.3,29.02
N$28
  Top 1.524: F1.P$2 14.73,42.73 14.73,46.04 14.99,46.29 D3.A
N$29
  Top 0.254: 26.16,10.22 26.16,10.73 R25.2 | 26.16,10.22 26.16,9.46 Q12.1 | 26.16,10.22 27.94,10.22 R49.1
N$30
  Top 0.254: 44.7,10.22 44.7,10.73 R31.2 | 44.7,10.22 44.7,9.46 Q15.1 | 44.7,10.22 46.23,10.22 R50.1
N$31
  Top 0.254: 49.78,10.22 49.78,10.73 R30.2 | 49.78,10.22 49.78,9.46 Q14.1 | 49.78,10.22 51.31,10.22 R51.1
N$35
  Top 0.254: 54.86,10.22 54.86,10.73 R29.2 | 54.86,10.22 54.86,9.46 Q13.1 | 54.86,10.22 56.39,10.22 R52.1
N$37
  Top 0.254: R32.2 50.29,52.64 49.53,52.64 R60.1 49.28,52.89 49.28,53.91 48.26,54.93 T1.1
N$38
  Top 0.254: Q1.3 5.59,51.12 5.59,56.7 2.79,59.5 B1.-
N$43  (via drill 0.51)
  Top 0.254: 54.61,52.64 55.37,52.64 R4.2 | 54.61,52.64 v54.61,51.37 | v53.09,56.7 53.09,55.43 53.34,55.18 T2.1 | R59.1 54.61,52.64
  Bottom 0.254: v54.61,51.37 54.61,55.18 v53.09,56.7
N$44
  Top 0.254: R5.2 45.21,52.64 44.45,52.64 R61.1 44.2,52.89 44.2,53.91 43.18,54.93 T3.1
N$60
  Top 0.254: 65.28,55.43 65.28,54.42 Q2.1 | 65.28,55.43 63.75,56.96 R9.2 | 65.28,55.43 R62.1
N$61
  Top 0.254: Q3.1 61.98,54.42 61.98,55.43 R63.1 61.72,55.43 60.2,56.96 R2.2
N$62
  Top 0.254: Q3.3 61.47,52.13 61.47,49.34 61.72,49.08 RELAY.3
N$63
  Top 0.254: Q2.3 64.52,52.13 64.52,49.08 RELAY.2
N$64
  Top 0.254: R72.2 69.6,30.8 69.6,31.56 R82.1 69.34,31.81 65.28,35.88 YMAX.1
N$67  (via drill 0.51)
  Top 0.254: R71.2 88.65,42.73 88.65,43.5 R81.1 88.39,43.75 v87.38,43.75
  Bottom 0.254: v87.38,43.75 87.38,44.26 84.33,47.31 ZMAX.1
N$82  (via drill 0.51)
  Top 0.254: R73.2 69.6,19.37 69.6,20.13 R83.1 69.34,20.38 v66.8,20.38
  Bottom 0.254: v66.8,20.38 66.29,20.38 65.79,20.89 64.77,20.89 64.01,21.65 64.01,23.43 65.02,24.45 XMAX.1
N$83  (via drill 0.51)
  Top 0.254: R68.2 88.65,53.66 88.65,54.42 R78.1 88.39,54.67 v86.87,54.67
  Bottom 0.254: v86.87,54.67 86.87,56.2 84.33,58.74 PLAY.1
N$84
  Top 0.254: R67.2 78.49,30.8 78.49,31.56 R77.1 78.49,31.81 79.5,32.83 79.5,33.59 77.22,35.88 74.17,35.88 TOOLZERO.1
N$85
  Top 0.254: R66.2 88.65,30.8 88.65,31.56 R76.1 88.39,31.81 84.33,35.88 ZMIN.1
N$86  (via drill 0.51)
  Top 0.254: R65.2 88.65,19.37 88.65,20.13 R75.1 88.39,20.38 v87.38,21.4
  Bottom 0.254: v87.38,21.4 84.33,24.45 YMIN.1
N$87
  Top 0.254: R64.2 78.49,19.37 78.49,20.13 R74.1 78.49,20.38 79.5,21.4 79.5,22.16 77.22,24.45 74.17,24.45 XMIN.1
N$88
  Top 0.254: R69.2 78.49,53.66 78.49,54.42 R79.1 78.23,54.67 74.17,58.74 TACH.1
N$89
  Top 0.254: R70.2 78.49,42.23 78.49,42.99 R80.1 78.23,43.24 74.17,47.31 DOOR.1
PLAY
  Top 0.254: R68.1 88.39,52.13 86.11,52.13 84.33,53.91 PLAY.3
PRE24
  Bottom 1.524: F1.P$1 14.48,37.65 9.65,37.65 7.37,39.94 X1.1
RED
  Top 0.254: U$1.D7 47.5,61.78 47.5,54.16 47.75,53.91 47.75,52.89 R60.2
REDOUT
  Top 0.254: T1.2 50.04,55.18 50.04,54.42 51.05,53.4 51.05,51.62 48.51,49.08 LEDS.3
RX1
  Top 0.254: U$1.D1 61.72,63.56 66.8,68.64 75.44,68.64 75.69,68.9 | 75.69,68.9 76.71,69.91 UART1.2 | U$1.D19 75.95,68.9 75.69,68.9
RX2
  Bottom 0.254: U$1.D17 75.44,63.56 70.36,68.64 64.77,68.64 UART2.2
RX3  (via drill 0.51)
  Top 0.254: v52.58,67.63 50.29,69.91 UART3.2
  Bottom 0.254: U$1.D15 70.36,63.56 69.09,62.29 67.31,62.29 61.98,67.63 v52.58,67.63
SCK  (via drill 0.51)
  Top 0.254: v8.89,24.19 6.86,24.19 U16.5 | v41.4,23.18 44.96,23.18 48.01,26.22 49.02,26.22 | 49.02,26.22 49.78,26.99 49.78,27.75 U$3.2 | 49.02,26.22 v49.78,25.46
  Bottom 0.254: U$1.D52 93.98,22.16 95.25,20.89 95.25,19.87 94.49,19.11 86.87,19.11 86.36,19.62 85.85,19.62 84.58,18.35 57.15,18.35 53.34,22.16 SPI.4 53.34,22.41 52.83,22.41 v49.78,25.46 | v8.89,24.19 36.58,24.19 38.35,22.41 40.64,22.41 v41.4,23.18
SCL
  Bottom 0.254: U$1.D21 86.36,66.1 I2C.2
SD_SELECT  (via drill 0.51)
  Top 0.254: v13.72,20.89 7.11,20.89 U16.2 | v40.13,20.64 40.64,20.64 41.66,19.62 60.71,19.62 61.98,20.89 66.04,20.89 v74.42,29.27
  Bottom 0.254: v13.72,20.89 14.73,20.89 15.24,21.4 39.37,21.4 v40.13,20.64 | v74.42,29.27 94.49,29.27 95.76,28 U$1.D49
SDA
  Bottom 0.254: U$1.D20 83.82,66.1 87.63,69.91 I2C.3
SPINDLE
  Top 0.254: U$1.D4 54.61,62.29 56.13,62.29 61.21,57.21 61.72,57.21 R63.2
SS  (via drill 0.51)
  Top 0.254: v70.1,27.75 61.21,27.75 v57.66,24.19
  Bottom 0.254: U$1.D53 95.76,22.92 94.49,24.19 92.46,24.19 88.9,27.75 v70.1,27.75 | v57.66,24.19 55.88,22.41 SPI.5
TACHOMETER
  Top 0.254: R69.1 78.23,52.13 75.95,52.13 74.17,53.91 TACH.3 73.91,54.16 69.34,58.74 63.25,58.74 U$1.D2
TOOLZERO  (via drill 0.51)
  Top 0.254: TOOLZERO.3 74.17,31.05 75.95,29.27 78.23,29.27 R67.1 78.49,29.27 80.01,30.8 80.01,33.84 v76.96,36.89 | v89.92,51.88 86.87,48.83 83.57,48.83 v81.03,46.29
  Bottom 0.254: v89.92,51.88 U$1.D26 | v81.03,46.29 73.66,46.29 72.9,45.53 72.9,40.96 v76.96,36.89
TX1
  Bottom 0.254: U$1.D18 78.74,65.59 74.42,69.91 UART1.3
TX2
  Bottom 0.254: U$1.D16 72.9,63.56 68.33,68.13 62.99,68.13 61.21,69.91 UART2.3
TX3
  Bottom 0.254: U$1.D14 66.8,63.56 61.72,68.64 49.02,68.64 47.75,69.91 UART3.3
VACUUM
  Top 0.254: U$1.D3 61.21,58.23 63.75,58.23 64.77,57.21 65.28,57.21 R62.2
VCC  (via drill 0.51)
  Top 0.254: 9.91,22.92 12.95,22.92 v15.49,20.38 | 9.91,22.92 6.6,22.92 U16.4 | 9.91,22.92 9.91,29.27 1.27,37.91 1.27,60.01 3.56,62.29 17.53,62.29 18.8,61.02 R12.E | 64.52,71.18 57.91,71.18 56.64,69.91 UART3.1 52.58,69.91 50.8,71.69 38.61,71.69 LCD.2 | 64.52,71.18 65.79,69.91 UART2.1 | 77.22,71.18 78.49,69.91 UART1.1 | 64.52,71.18 77.22,71.18 | 91.95,69.91 90.68,71.18 77.22,71.18 | 91.95,69.91 I2C.1 92.46,69.91 | U$3.7 49.78,33.08 48.77,33.08 U$3.8 48.51,33.08 48.51,39.43 48.01,39.94 DPOT.1 | R79.2 78.49,55.94 83.06,55.94 83.82,55.18 86.11,55.18 86.87,55.94 88.39,55.94 R78.2 88.65,55.94 89.66,54.93 | 72.9,33.08 69.6,33.08 R82.2 | 72.9,33.08 73.66,32.32 77.47,32.32 78.23,33.08 R77.2 | 72.9,21.65 69.6,21.65 R83.2 | 72.9,21.65 73.66,20.89 77.47,20.89 78.23,21.65 R74.2 | v88.65,22.92 88.65,21.91 R75.2 | v88.65,26.73 90.93,29.02 90.93,30.8 88.65,33.08 R76.2 88.39,33.34 88.39,35.62 85.09,38.92 | 80.26,43.75 85.09,38.92 | 80.26,43.75 79.5,44.51 78.49,44.51 R80.2 | 80.26,43.75 84.58,43.75 85.85,45.02 88.39,45.02 R81.2 88.65,45.02 90.93,47.31 90.93,53.66 89.66,54.93 | 72.9,21.65 72.9,25.21 75.95,28.26 78.99,28.26 83.06,32.32 83.06,36.89 | 85.09,38.92 83.06,36.89 | 72.9,33.08 72.9,36.64 73.66,37.4 | 73.66,37.4 74.17,37.91 82.04,37.91 83.06,36.89 | v62.48,36.13 63.5,36.13 64.77,37.4 73.66,37.4 | 91.95,69.91 91.95,67.63 89.66,65.34 89.66,54.93
  Bottom 0.254: v15.49,20.38 17.53,20.38 21.84,16.06 24.13,16.06 25.4,14.79 JP1.2 | LCD.2 38.1,68.64 38.1,63.05 37.34,62.29 21.08,62.29 19.81,61.02 R12.E | 45.97,36.13 45.97,38.16 47.75,39.94 DPOT.1 | 45.97,36.13 45.97,22.41 SPI.1 | v88.65,26.73 v88.65,22.92 | v62.48,36.13 45.97,36.13
VIN
  Top 1.524: U$1.VIN 45.72,15.81 43.69,17.84 39.88,17.84 MODULE1.OUT+
  Bottom 1.524: LEDS.1 53.34,48.83 53.34,48.07 47.5,42.23 46.99,42.23 43.69,38.92 43.69,23.18 43.43,22.92 43.43,21.14 40.39,18.1 39.88,18.1 MODULE1.OUT+
XDIR  (via drill 0.51)
  Top 0.254: v14.22,12.25 14.73,11.75 16.51,11.75 R3.2
  Bottom 0.254: v14.22,12.25 11.18,12.25 6.86,16.57 6.86,26.73 20.32,40.19 41.66,40.19 49.78,48.32 49.78,49.34 51.05,50.61 54.1,50.61 55.12,49.59 55.12,47.56 54.61,47.05 54.61,46.54 55.37,45.78 65.53,45.78 68.07,48.32 68.07,49.08 68.83,49.85 80.26,49.85 83.82,46.29 84.58,46.29 86.36,44.51 86.36,43.5 87.12,42.73 90.93,42.73 U$1.D34
XDIRIN
  Top 0.254: 14.73,10.22 14.73,10.73 R16.2 | 14.73,10.22 14.73,9.46 Q8.1 | 14.73,10.22 16.51,10.22 R3.1
XDIROUT
  Top 0.254: Q8.3 13.97,5.65 12.19,3.87 X.4
XENABLE  (via drill 0.51)
  Top 0.254: v39.37,28.26 41.4,26.22 46.74,26.22 v47.24,26.73 | v56.9,34.1 58.17,35.37 58.17,35.62 61.98,39.43 80.77,39.43 v82.04,40.7 | R46.2 v11.43,13.27
  Bottom 0.254: v11.43,13.27 11.43,19.62 7.37,23.68 7.37,26.48 8.89,28 39.12,28 v39.37,28.26 | v47.24,26.73 49.02,26.73 56.39,34.1 v56.9,34.1 | v82.04,40.7 89.66,40.7 93.47,44.51 94.49,44.51 95.76,45.78 U$1.D35
XENABLEIN
  Top 0.254: 9.65,10.22 9.65,10.73 R17.2 | 9.65,10.22 9.65,9.46 Q9.1 | 9.65,10.22 11.43,10.22 R46.1
XENABLEOUT
  Top 0.254: Q9.3 8.89,5.65 7.11,3.87 X.6
XMAX  (via drill 0.51)
  Top 0.254: R73.1 69.34,17.84 67.06,17.84 65.28,19.62 XMAX.3 | v98.81,47.56 98.81,36.64 v98.04,35.88 | v82.8,30.29 82.8,25.72 80.52,23.43 v80.52,21.4
  Bottom 0.254: U$1.D28 94.74,53.4 96.01,52.13 97.03,52.13 98.81,50.35 v98.81,47.56 | v98.04,35.88 97.03,36.89 91.69,36.89 84.58,29.78 83.31,29.78 v82.8,30.29 | v80.52,21.4 74.93,21.4 74.42,20.89 68.58,20.89 67.06,19.37 65.53,19.37 65.28,19.62 XMAX.3
XMIN  (via drill 0.51)
  Top 0.254: R64.1 78.23,17.84 75.95,17.84 74.17,19.62 XMIN.3 73.91,19.62 71.12,16.83 66.29,16.83 v63.5,19.62 | v79.76,51.88 78.23,50.35 73.66,50.35 v64.26,40.96
  Bottom 0.254: U$1.D27 95.76,55.94 94.49,54.67 93.47,54.67 92.71,53.91 92.71,52.89 93.47,52.13 94.49,52.13 95.25,51.37 95.25,50.35 94.49,49.59 84.33,49.59 83.06,48.32 82.55,48.32 79.76,51.12 v79.76,51.88 | v64.26,40.96 64.26,36.89 63.5,36.13 v63.5,19.62
XSTEP  (via drill 0.51)
  Top 0.254: v18.03,15.3 21.59,11.75 R1.2 | v41.66,31.3 v47.5,37.15 | v82.55,46.29 v88.65,46.29
  Bottom 0.254: v18.03,15.3 16.51,15.3 7.87,23.94 7.87,26.22 8.89,27.24 39.62,27.24 41.66,29.27 v41.66,31.3 | v47.5,37.15 59.18,37.15 70.87,48.83 80.01,48.83 v82.55,46.29 | v88.65,46.29 92.71,46.29 93.47,47.05 95.25,47.05 U$1.D33
XSTEPIN
  Top 0.254: 19.81,10.22 19.81,10.73 R10.2 | 19.81,10.22 19.81,9.46 Q7.1 | 19.81,10.22 21.59,10.22 R1.1
XSTEPOUT
  Top 0.254: Q7.3 19.05,5.65 17.27,3.87 X.2
YDIR  (via drill 0.51)
  Top 0.254: v30.48,16.06 33.02,13.52 R48.2 | v28.45,18.1 28.45,19.62 36.32,27.49 v36.32,41.21
  Bottom 0.254: v30.48,16.06 v28.45,18.1 | v36.32,41.21 56.39,61.28 92.46,61.28 93.47,62.29 97.03,62.29 100.33,58.99 100.33,47.05 U$1.D37
YDIROUT
  Top 0.254: Y.4 Q11.3
YENABLE  (via drill 0.51)
  Top 0.254: v26.67,12.25 27.18,11.75 27.94,11.75 R49.2 | v94.74,13.78 99.06,18.1 99.57,18.1 100.58,17.08 v100.58,15.81
  Bottom 0.254: v26.67,12.25 31.24,12.25 36.58,6.92 89.92,6.92 94.74,11.75 v94.74,13.78 | v100.58,15.81 100.58,16.32 100.84,16.57 100.84,38.16 97.03,41.97 95.25,41.97 U$1.D38
YENABLEOUT
  Top 0.254: Q12.3 25.4,3.87 Y.6
YMAX  (via drill 0.51)
  Top 0.254: R72.1 69.34,29.27 67.06,29.27 65.28,31.05 YMAX.3 65.02,31.3 58.42,31.3 55.88,33.84 55.88,34.35 61.47,39.94 64.52,39.94 65.28,40.7 65.28,41.21 73.91,49.85 78.49,49.85 79.5,50.86 v85.6,50.86
  Bottom 0.254: v85.6,50.86 U$1.D30
YMIN
  Top 0.254: YMIN.3 84.33,19.62 84.33,19.11 85.85,17.59 88.39,17.59 R65.1 88.65,17.84 92.46,21.65 94.49,21.65 95.25,22.41 95.25,31.05 96.01,31.81 97.03,31.81 99.82,34.61 99.82,50.1 U$1.D29
YSTEP  (via drill 0.51)
  Top 0.254: v55.63,46.8 53.09,46.8 36.83,30.54 36.83,14.79 38.1,13.52 R47.2
  Bottom 0.254: v55.63,46.8 69.6,60.77 92.46,60.77 93.47,59.75 97.03,59.75 99.82,56.96 99.82,47.31 97.03,44.51 95.25,44.51 U$1.D36
YSTEPOUT
  Top 0.254: Y.2 Q10.3
ZDIR  (via drill 0.51)
  Top 0.254: v50.29,12.25 50.8,11.75 51.31,11.75 R51.2 | v59.44,24.7 63.5,24.7 65.53,26.73 70.36,26.73 72.39,28.76 v72.39,31.3
  Bottom 0.254: v50.29,12.25 50.29,14.03 46.99,17.33 46.99,23.94 49.53,26.48 57.66,26.48 v59.44,24.7 | v72.39,31.3 73.41,32.32 84.58,32.32 88.14,35.88 88.14,37.91 88.9,38.67 93.47,38.67 U$1.D40
ZDIROUT
  Top 0.254: Q14.3 49.02,7.17 49.02,3.87 Z.4
ZENABLE  (via drill 0.51)
  Top 0.254: v40.89,5.9 40.89,11.24 41.66,12 42.16,12 42.42,11.75 46.23,11.75 R50.2
  Bottom 0.254: v40.89,5.9 89.66,5.9 95.25,11.49 95.25,11.75 100.33,16.83 100.33,34.86 97.03,38.16 U$1.D41
ZENABLEOUT
  Top 0.254: Q15.3 43.94,7.17 43.94,3.87 Z.6
ZMAX
  Top 0.254: ZMAX.3 84.33,42.48 85.6,41.21 88.39,41.21 R71.1 88.65,41.21 89.66,42.23 89.66,43.24 93.98,47.56 U$1.D32
ZMIN  (via drill 0.51)
  Top 0.254: R66.1 88.39,29.27 86.11,29.27 84.33,31.05 ZMIN.3 | U$1.D31 96.52,50.1 95.25,48.83 95.25,42.73 94.49,41.97 93.47,41.97 v89.15,37.65
  Bottom 0.254: v89.15,37.65 89.15,36.13 84.33,31.3 ZMIN.3
ZSTEP  (via drill 0.51)
  Top 0.254: v62.23,19.87 62.23,8.7 61.98,8.44 60.2,8.44 57.15,11.49 56.64,11.49 R52.2 | v59.69,33.84 58.67,34.86 58.67,35.37 62.23,38.92 81.79,38.92 v82.3,39.43
  Bottom 0.254: v62.23,19.87 62.23,31.3 v59.69,33.84 | v82.3,39.43 95.25,39.43 U$1.D39
ZSTEPOUT
  Top 0.254: Q13.3 54.1,7.17 54.1,3.87 Z.2

### Text on the board
tPlace: GND | +++ | B | R | G | + | GND | License: GPLv3 | Copyright 2012 | Design by: Zach Hoeken | Hoektronics::CNC | Rev C | 3.3V | 5V | X | B